# EAGLE design Transducer_board_niall (EAGLE 9.2.0)
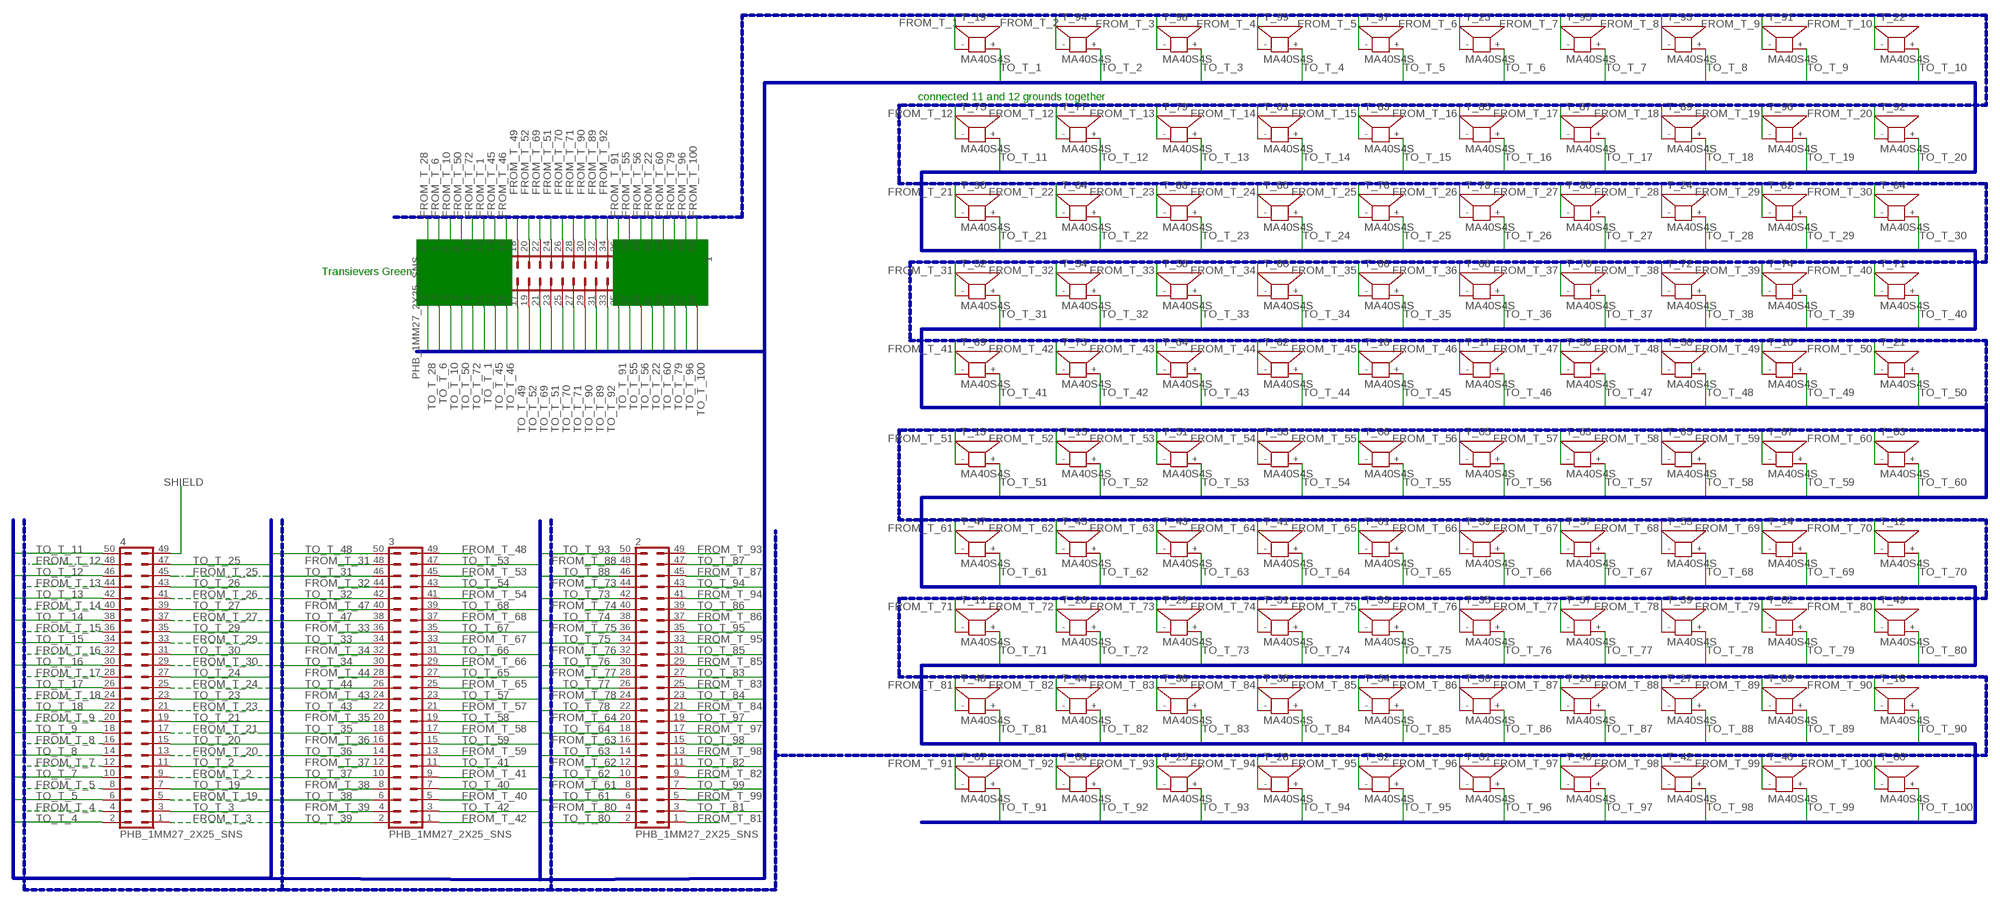
[diagram p0: schematic, sheet 1]

## Parts
1  PHB_1MM27_2X25_SNS  [PHB_1MM27_2X25_SNS]
2  PHB_1MM27_2X25_SNS  [PHB_1MM27_2X25_SNS]
3  PHB_1MM27_2X25_SNS  [PHB_1MM27_2X25_SNS]
4  PHB_1MM27_2X25_SNS  [PHB_1MM27_2X25_SNS]
T_00  MA40S4S  [MA40]
T_01  MA40S4S  [MA40]
T_02  MA40S4S  [MA40]
T_03  MA40S4S  [MA40]
T_04  MA40S4S  [MA40]
T_05  MA40S4S  [MA40]
T_06  MA40S4S  [MA40]
T_07  MA40S4S  [MA40]
T_08  MA40S4S  [MA40]
T_09  MA40S4S  [MA40]
T_10  MA40S4S  [MA40]
T_11  MA40S4S  [MA40]
T_12  MA40S4S  [MA40]
T_13  MA40S4S  [MA40]
T_14  MA40S4S  [MA40]
T_15  MA40S4S  [MA40]
T_16  MA40S4S  [MA40]
T_17  MA40S4S  [MA40]
T_18  MA40S4S  [MA40]
T_19  MA40S4S  [MA40]
T_20  MA40S4S  [MA40]
T_21  MA40S4S  [MA40]
T_22  MA40S4S  [MA40]
T_23  MA40S4S  [MA40]
T_24  MA40S4S  [MA40]
T_25  MA40S4S  [MA40]
T_26  MA40S4S  [MA40]
T_27  MA40S4S  [MA40]
T_28  MA40S4S  [MA40]
T_29  MA40S4S  [MA40]
T_30  MA40S4S  [MA40]
T_31  MA40S4S  [MA40]
T_32  MA40S4S  [MA40]
T_33  MA40S4S  [MA40]
T_34  MA40S4S  [MA40]
T_35  MA40S4S  [MA40]
T_36  MA40S4S  [MA40]
T_37  MA40S4S  [MA40]
T_38  MA40S4S  [MA40]
T_39  MA40S4S  [MA40]
T_40  MA40S4S  [MA40]
T_41  MA40S4S  [MA40]
T_42  MA40S4S  [MA40]
T_43  MA40S4S  [MA40]
T_44  MA40S4S  [MA40]
T_45  MA40S4S  [MA40]
T_46  MA40S4S  [MA40]
T_47  MA40S4S  [MA40]
T_48  MA40S4S  [MA40]
T_49  MA40S4S  [MA40]
T_50  MA40S4S  [MA40]
T_51  MA40S4S  [MA40]
T_52  MA40S4S  [MA40]
T_53  MA40S4S  [MA40]
T_54  MA40S4S  [MA40]
T_55  MA40S4S  [MA40]
T_56  MA40S4S  [MA40]
T_57  MA40S4S  [MA40]
T_58  MA40S4S  [MA40]
T_59  MA40S4S  [MA40]
T_60  MA40S4S  [MA40]
T_61  MA40S4S  [MA40]
T_62  MA40S4S  [MA40]
T_63  MA40S4S  [MA40]
T_64  MA40S4S  [MA40]
T_65  MA40S4S  [MA40]
T_66  MA40S4S  [MA40]
T_67  MA40S4S  [MA40]
T_68  MA40S4S  [MA40]
T_69  MA40S4S  [MA40]
T_70  MA40S4S  [MA40]
T_71  MA40S4S  [MA40]
T_72  MA40S4S  [MA40]
T_73  MA40S4S  [MA40]
T_74  MA40S4S  [MA40]
T_75  MA40S4S  [MA40]
T_76  MA40S4S  [MA40]
T_77  MA40S4S  [MA40]
T_78  MA40S4S  [MA40]
T_79  MA40S4S  [MA40]
T_80  MA40S4S  [MA40]
T_81  MA40S4S  [MA40]
T_82  MA40S4S  [MA40]
T_83  MA40S4S  [MA40]
T_84  MA40S4S  [MA40]
T_85  MA40S4S  [MA40]
T_86  MA40S4S  [MA40]
T_87  MA40S4S  [MA40]
T_88  MA40S4S  [MA40]
T_89  MA40S4S  [MA40]
T_90  MA40S4S  [MA40]
T_91  MA40S4S  [MA40]
T_92  MA40S4S  [MA40]
T_93  MA40S4S  [MA40]
T_94  MA40S4S  [MA40]
T_95  MA40S4S  [MA40]
T_96  MA40S4S  [MA40]
T_97  MA40S4S  [MA40]
T_98  MA40S4S  [MA40]
T_99  MA40S4S  [MA40]

## Nets
FROM_T_1: 1.12 T_19.-
FROM_T_2: 4.9 T_94.-
FROM_T_3: 4.1 T_98.-
FROM_T_4: 4.4 T_99.-
FROM_T_5: 4.8 T_97.-
FROM_T_6: 1.4 T_23.-
FROM_T_7: 4.12 T_95.-
FROM_T_8: 4.16 T_93.-
FROM_T_9: 4.20 T_91.-
FROM_T_10: 1.6 T_22.-
FROM_T_12: 4.48 T_75.- T_77.-
FROM_T_13: 4.44 T_79.-
FROM_T_14: 4.40 T_81.-
FROM_T_15: 4.36 T_83.-
FROM_T_16: 4.32 T_85.-
FROM_T_17: 4.28 T_87.-
FROM_T_18: 4.24 T_89.-
FROM_T_19: 4.5 T_96.-
FROM_T_20: 4.13 T_92.-
FROM_T_21: 4.17 T_90.-
FROM_T_22: 1.42 T_04.-
FROM_T_23: 4.21 T_88.-
FROM_T_24: 4.25 T_86.-
FROM_T_25: 4.45 T_76.-
FROM_T_26: 4.41 T_78.-
FROM_T_27: 4.37 T_80.-
FROM_T_28: 1.2 T_24.-
FROM_T_29: 4.33 T_82.-
FROM_T_30: 4.29 T_84.-
FROM_T_31: 3.48 T_52.-
FROM_T_32: 3.44 T_54.-
FROM_T_33: 3.36 T_58.-
FROM_T_34: 3.32 T_60.-
FROM_T_35: 3.20 T_66.-
FROM_T_36: 3.16 T_68.-
FROM_T_37: 3.12 T_70.-
FROM_T_38: 3.8 T_72.-
FROM_T_39: 3.4 T_74.-
FROM_T_40: 3.5 T_71.-
FROM_T_41: 3.9 T_69.-
FROM_T_42: 3.1 T_73.-
FROM_T_43: 3.24 T_64.-
FROM_T_44: 3.28 T_62.-
FROM_T_45: 1.14 T_18.-
FROM_T_46: 1.16 T_17.-
FROM_T_47: 3.40 T_56.-
FROM_T_48: 3.49 T_50.-
FROM_T_49: 1.18 T_16.-
FROM_T_50: 1.8 T_21.-
FROM_T_51: 1.24 T_13.-
FROM_T_52: 1.20 T_15.-
FROM_T_53: 3.45 T_51.-
FROM_T_54: 3.41 T_53.-
FROM_T_55: 1.38 T_06.-
FROM_T_56: 1.40 T_05.-
FROM_T_57: 3.21 T_63.-
FROM_T_58: 3.17 T_65.-
FROM_T_59: 3.13 T_67.-
FROM_T_60: 1.44 T_03.-
FROM_T_61: 2.8 T_47.-
FROM_T_62: 2.12 T_45.-
FROM_T_63: 2.16 T_43.-
FROM_T_64: 2.20 T_41.-
FROM_T_65: 3.25 T_61.-
FROM_T_66: 3.29 T_59.-
FROM_T_67: 3.33 T_57.-
FROM_T_68: 3.37 T_55.-
FROM_T_69: 1.22 T_14.-
FROM_T_70: 1.26 T_12.-
FROM_T_71: 1.28 T_11.-
FROM_T_72: 1.10 T_20.-
FROM_T_73: 2.44 T_29.-
FROM_T_74: 2.40 T_31.-
FROM_T_75: 2.36 T_33.-
FROM_T_76: 2.32 T_35.-
FROM_T_77: 2.28 T_37.-
FROM_T_78: 2.24 T_39.-
FROM_T_79: 1.46 T_02.-
FROM_T_80: 2.4 T_49.-
FROM_T_81: 2.1 T_48.-
FROM_T_82: 2.9 T_44.-
FROM_T_83: 2.25 T_36.-
FROM_T_84: 2.21 T_38.-
FROM_T_85: 2.29 T_34.-
FROM_T_86: 2.37 T_30.-
FROM_T_87: 2.45 T_26.-
FROM_T_88: 2.48 T_27.-
FROM_T_89: 1.32 T_09.-
FROM_T_90: 1.30 T_10.-
FROM_T_91: 1.36 T_07.-
FROM_T_92: 1.34 T_08.-
FROM_T_93: 2.49 T_25.-
FROM_T_94: 2.41 T_28.-
FROM_T_95: 2.33 T_32.-
FROM_T_96: 1.48 T_01.-
FROM_T_97: 2.17 T_40.-
FROM_T_98: 2.13 T_42.-
FROM_T_99: 2.5 T_46.-
FROM_T_100: 1.50 T_00.-
SHIELD: 4.49
TO_T_1: 1.11 T_19.+
TO_T_2: 4.11 T_94.+
TO_T_3: 4.3 T_98.+
TO_T_4: 4.2 T_99.+
TO_T_5: 4.6 T_97.+
TO_T_6: 1.3 T_23.+
TO_T_7: 4.10 T_95.+
TO_T_8: 4.14 T_93.+
TO_T_9: 4.18 T_91.+
TO_T_10: 1.5 T_22.+
TO_T_11: 4.50 T_75.+
TO_T_12: 4.46 T_77.+
TO_T_13: 4.42 T_79.+
TO_T_14: 4.38 T_81.+
TO_T_15: 4.34 T_83.+
TO_T_16: 4.30 T_85.+
TO_T_17: 4.26 T_87.+
TO_T_18: 4.22 T_89.+
TO_T_19: 4.7 T_96.+
TO_T_20: 4.15 T_92.+
TO_T_21: 4.19 T_90.+
TO_T_22: 1.41 T_04.+
TO_T_23: 4.23 T_88.+
TO_T_24: 4.27 T_86.+
TO_T_25: 4.47 T_76.+
TO_T_26: 4.43 T_78.+
TO_T_27: 4.39 T_80.+
TO_T_28: 1.1 T_24.+
TO_T_29: 4.35 T_82.+
TO_T_30: 4.31 T_84.+
TO_T_31: 3.46 T_52.+
TO_T_32: 3.42 T_54.+
TO_T_33: 3.34 T_58.+
TO_T_34: 3.30 T_60.+
TO_T_35: 3.18 T_66.+
TO_T_36: 3.14 T_68.+
TO_T_37: 3.10 T_70.+
TO_T_38: 3.6 T_72.+
TO_T_39: 3.2 T_74.+
TO_T_40: 3.7 T_71.+
TO_T_41: 3.11 T_69.+
TO_T_42: 3.3 T_73.+
TO_T_43: 3.22 T_64.+
TO_T_44: 3.26 T_62.+
TO_T_45: 1.13 T_18.+
TO_T_46: 1.15 T_17.+
TO_T_47: 3.38 T_56.+
TO_T_48: 3.50 T_50.+
TO_T_49: 1.17 T_16.+
TO_T_50: 1.7 T_21.+
TO_T_51: 1.23 T_13.+
TO_T_52: 1.19 T_15.+
TO_T_53: 3.47 T_51.+
TO_T_54: 3.43 T_53.+
TO_T_55: 1.37 T_06.+
TO_T_56: 1.39 T_05.+
TO_T_57: 3.23 T_63.+
TO_T_58: 3.19 T_65.+
TO_T_59: 3.15 T_67.+
TO_T_60: 1.43 T_03.+
TO_T_61: 2.6 T_47.+
TO_T_62: 2.10 T_45.+
TO_T_63: 2.14 T_43.+
TO_T_64: 2.18 T_41.+
TO_T_65: 3.27 T_61.+
TO_T_66: 3.31 T_59.+
TO_T_67: 3.35 T_57.+
TO_T_68: 3.39 T_55.+
TO_T_69: 1.21 T_14.+
TO_T_70: 1.25 T_12.+
TO_T_71: 1.27 T_11.+
TO_T_72: 1.9 T_20.+
TO_T_73: 2.42 T_29.+
TO_T_74: 2.38 T_31.+
TO_T_75: 2.34 T_33.+
TO_T_76: 2.30 T_35.+
TO_T_77: 2.26 T_37.+
TO_T_78: 2.22 T_39.+
TO_T_79: 1.45 T_02.+
TO_T_80: 2.2 T_49.+
TO_T_81: 2.3 T_48.+
TO_T_82: 2.11 T_44.+
TO_T_83: 2.27 T_36.+
TO_T_84: 2.23 T_38.+
TO_T_85: 2.31 T_34.+
TO_T_86: 2.39 T_30.+
TO_T_87: 2.47 T_26.+
TO_T_88: 2.46 T_27.+
TO_T_89: 1.31 T_09.+
TO_T_90: 1.29 T_10.+
TO_T_91: 1.35 T_07.+
TO_T_92: 1.33 T_08.+
TO_T_93: 2.50 T_25.+
TO_T_94: 2.43 T_28.+
TO_T_95: 2.35 T_32.+
TO_T_96: 1.47 T_01.+
TO_T_97: 2.19 T_40.+
TO_T_98: 2.15 T_42.+
TO_T_99: 2.7 T_46.+
TO_T_100: 1.49 T_00.+

## Buses
TO_T:TO_T_1,TO_T_2,TO_T_3,TO_T_4,TO_T_5,TO_T_6,TO_T_7,TO_T_8,TO_T_9,TO_T_10,TO_T_11,TO_T_12,TO_T_13,TO_T_14,TO_T_15,TO_T_16,TO_T_17,TO_T_18,TO_T_19,TO_T_20,TO_T_21,TO_T_22,TO_T_23,TO_T_24,TO_T_25,TO_T_26,TO_T_27,TO_T_28,TO_T_29,TO_T_30,TO_T_31,TO_T_32,TO_T_33,TO_T_34,TO_T_35,TO_T_36,TO_T_37,TO_T_38,TO_T_39,TO_T_40,TO_T_41,TO_T_42,TO_T_43,TO_T_44,TO_T_45,TO_T_46,TO_T_47,TO_T_48,TO_T_49,TO_T_50,TO_T_51,TO_T_52,TO_T_53,TO_T_54,TO_T_55,TO_T_56,TO_T_57,TO_T_58,TO_T_59,TO_T_60,TO_T_61,TO_T_62,TO_T_63,TO_T_64,TO_T_65,TO_T_66,TO_T_67,TO_T_68,TO_T_69,TO_T_70,TO_T_71,TO_T_72,TO_T_73,TO_T_74,TO_T_75,TO_T_76,TO_T_77,TO_T_78,TO_T_79,TO_T_80,TO_T_81,TO_T_82,TO_T_83,TO_T_84,TO_T_85,TO_T_86,TO_T_87,TO_T_88,TO_T_89,TO_T_90,TO_T_91,TO_T_92,TO_T_93,TO_T_94,TO_T_95,TO_T_96,TO_T_97,TO_T_98,TO_T_99,TO_T_100
FROM_T:FROM_T_1,FROM_T_2,FROM_T_3,FROM_T_4,FROM_T_5,FROM_T_6,FROM_T_7,FROM_T_8,FROM_T_9,FROM_T_10,FROM_T_11,FROM_T_12,FROM_T_13,FROM_T_14,FROM_T_15,FROM_T_16,FROM_T_17,FROM_T_18,FROM_T_19,FROM_T_20,FROM_T_21,FROM_T_22,FROM_T_23,FROM_T_24,FROM_T_25,FROM_T_26,FROM_T_27,FROM_T_28,FROM_T_29,FROM_T_30,FROM_T_31,FROM_T_32,FROM_T_33,FROM_T_34,FROM_T_35,FROM_T_36,FROM_T_37,FROM_T_38,FROM_T_39,FROM_T_40,FROM_T_41,FROM_T_42,FROM_T_43,FROM_T_44,FROM_T_45,FROM_T_46,FROM_T_47,FROM_T_48,FROM_T_49,FROM_T_50,FROM_T_51,FROM_T_52,FROM_T_53,FROM_T_54,FROM_T_55,FROM_T_56,FROM_T_57,FROM_T_58,FROM_T_59,FROM_T_60,FROM_T_61,FROM_T_62,FROM_T_63,FROM_T_64,FROM_T_65,FROM_T_66,FROM_T_67,FROM_T_68,FROM_T_69,FROM_T_70,FROM_T_71,FROM_T_72,FROM_T_73,FROM_T_74,FROM_T_75,FROM_T_76,FROM_T_77,FROM_T_78,FROM_T_79,FROM_T_80,FROM_T_81,FROM_T_82,FROM_T_83,FROM_T_84,FROM_T_85,FROM_T_86,FROM_T_87,FROM_T_88,FROM_T_89,FROM_T_90,FROM_T_91,FROM_T_92,FROM_T_93,FROM_T_94,FROM_T_95,FROM_T_96,FROM_T_97,FROM_T_98,FROM_T_99,FROM_T_100

## Notes on the sheet
- connected 11 and 12 grounds together
- Transievers Green

## Library data of the parts
1-4 = _hhn_con_pinhead_box_1mm27:PHB_1MM27_2X25_*: Pin Header Box-Type, 1.27mm/0.5"/50mil Pitch, 2x25 Circuits Note: see library description for an important note about THT-version
T_00 T_01-T_09 T_10-T_99 = Parts:MA40S4S: SPEAKER Source: Buerklin

## Board
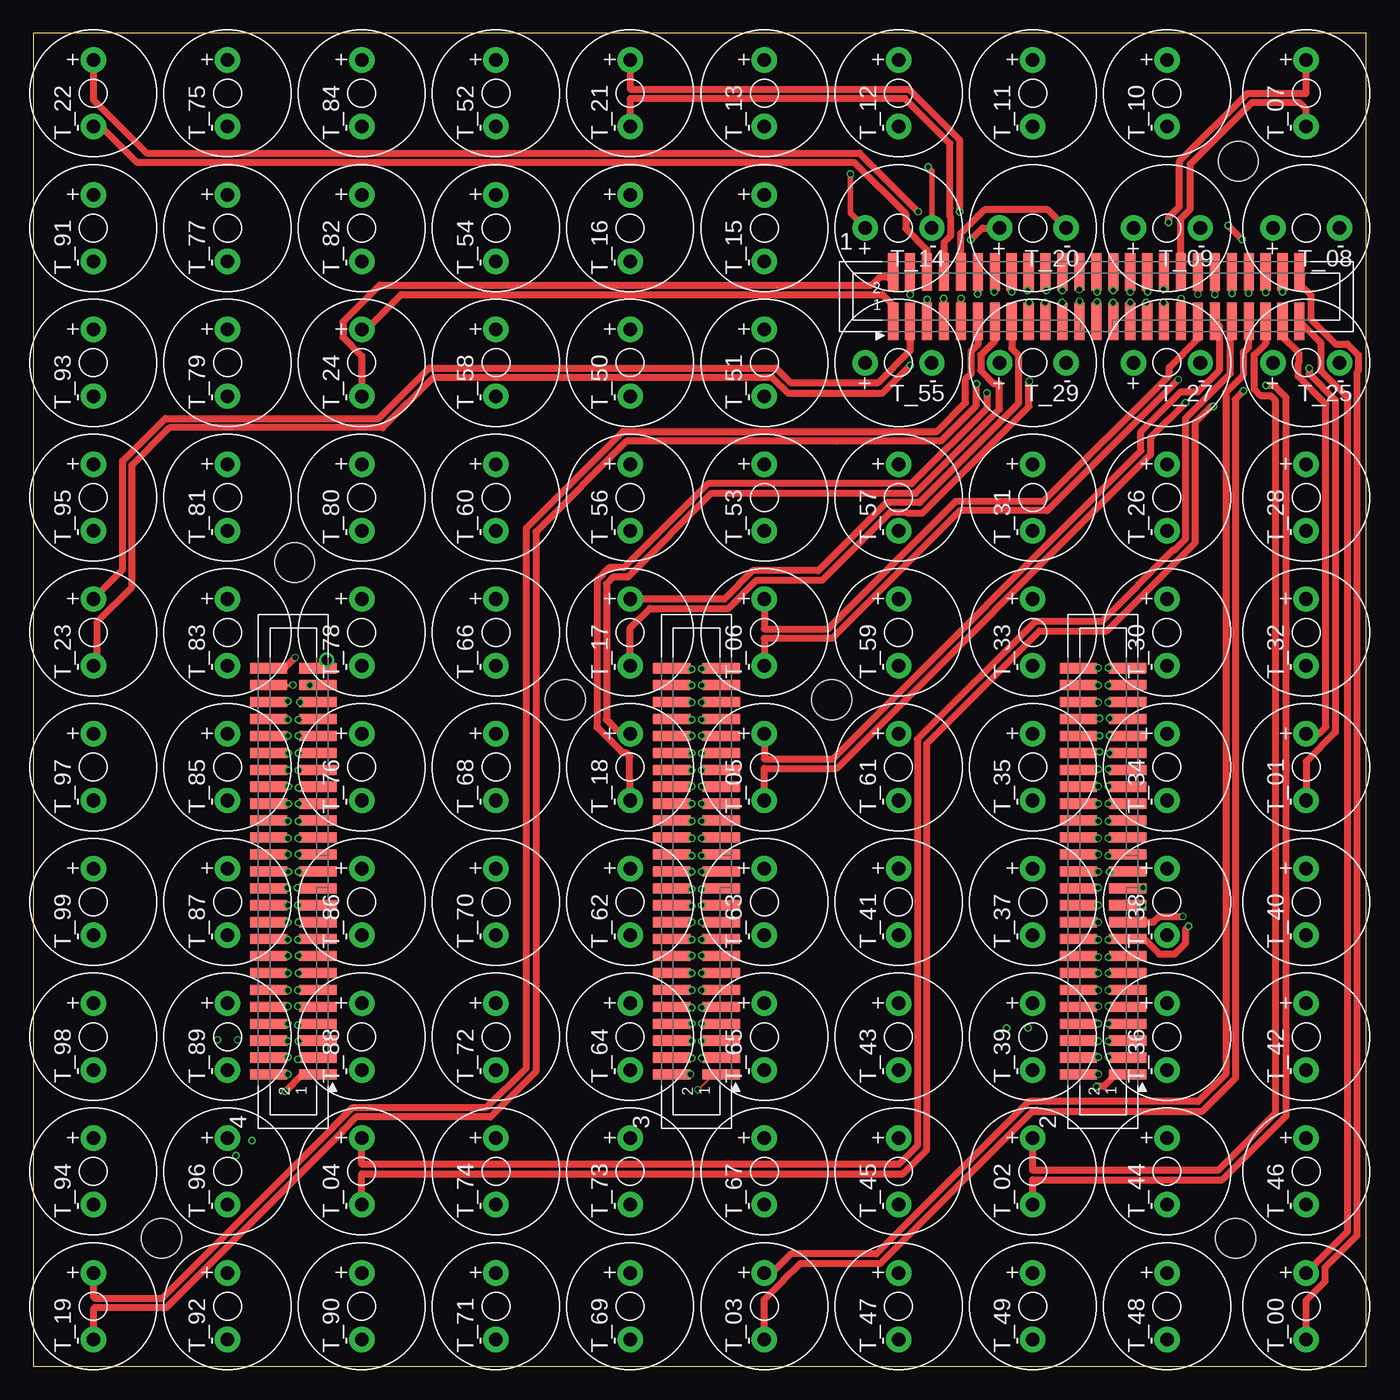
[diagram p1: board, top side]
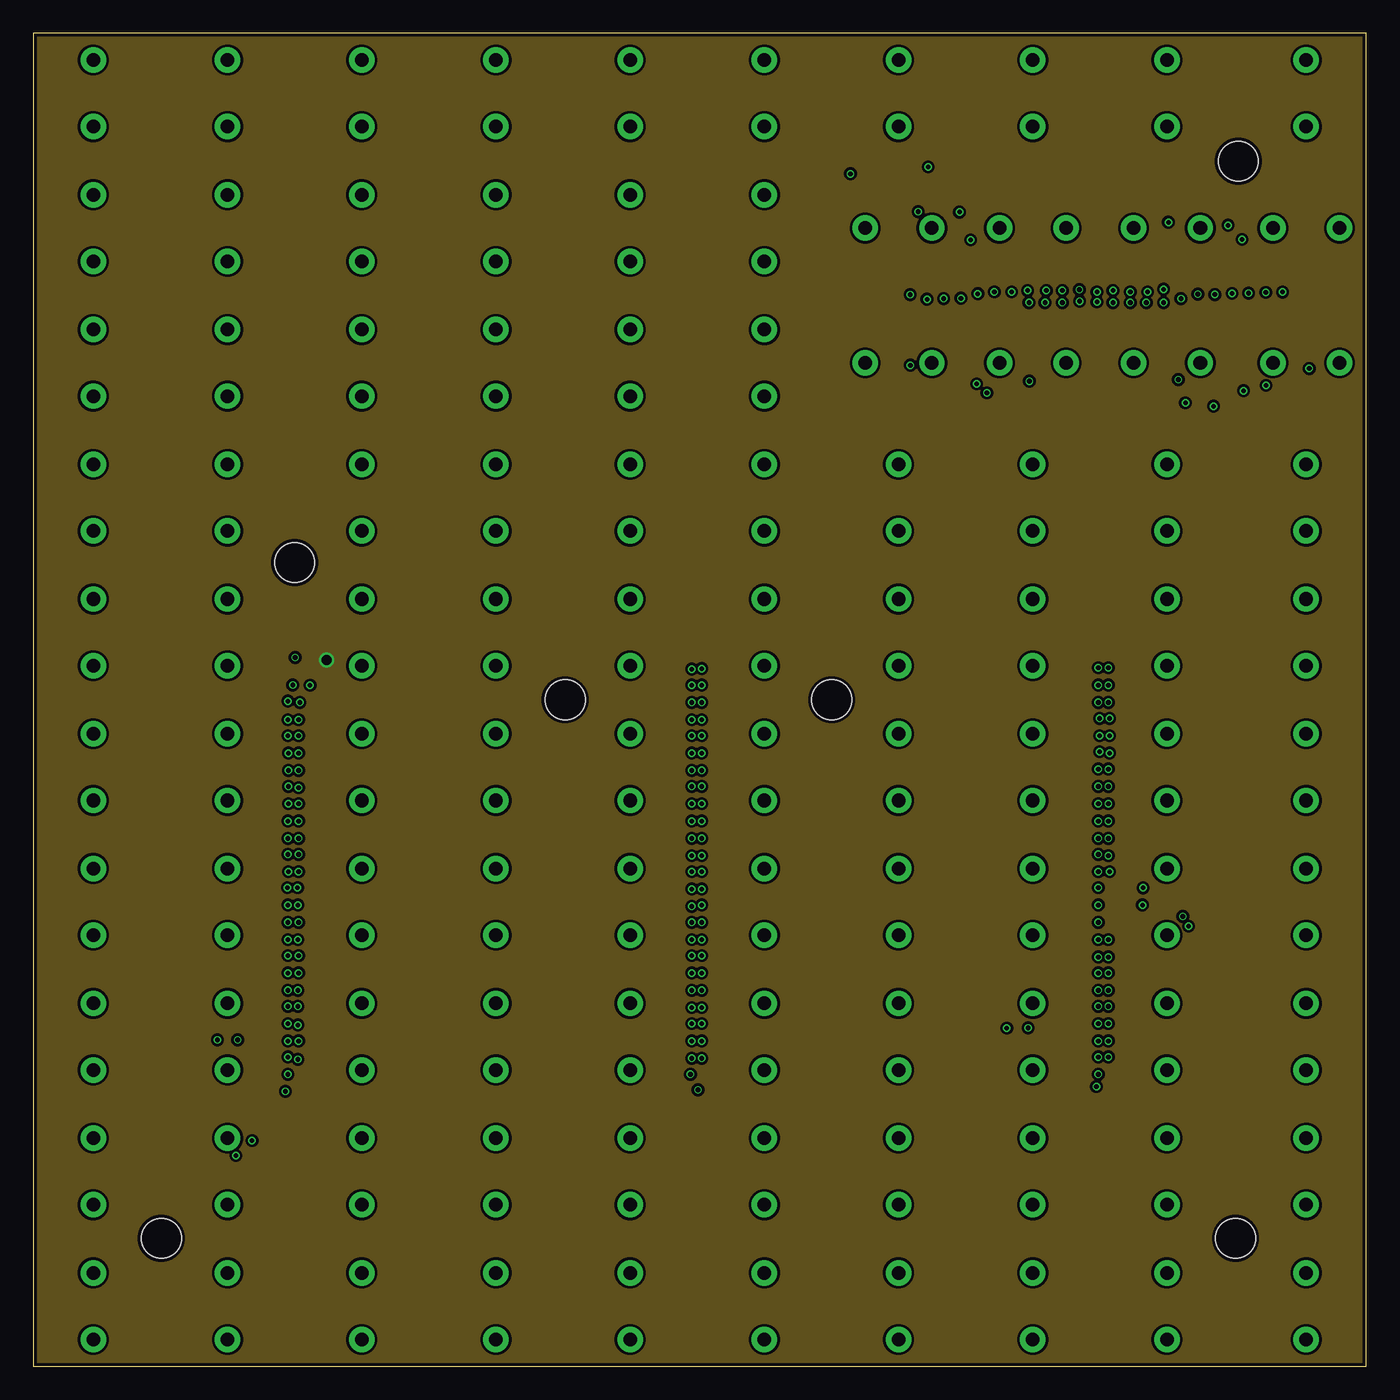
[diagram p2: board, inner layer Shield]
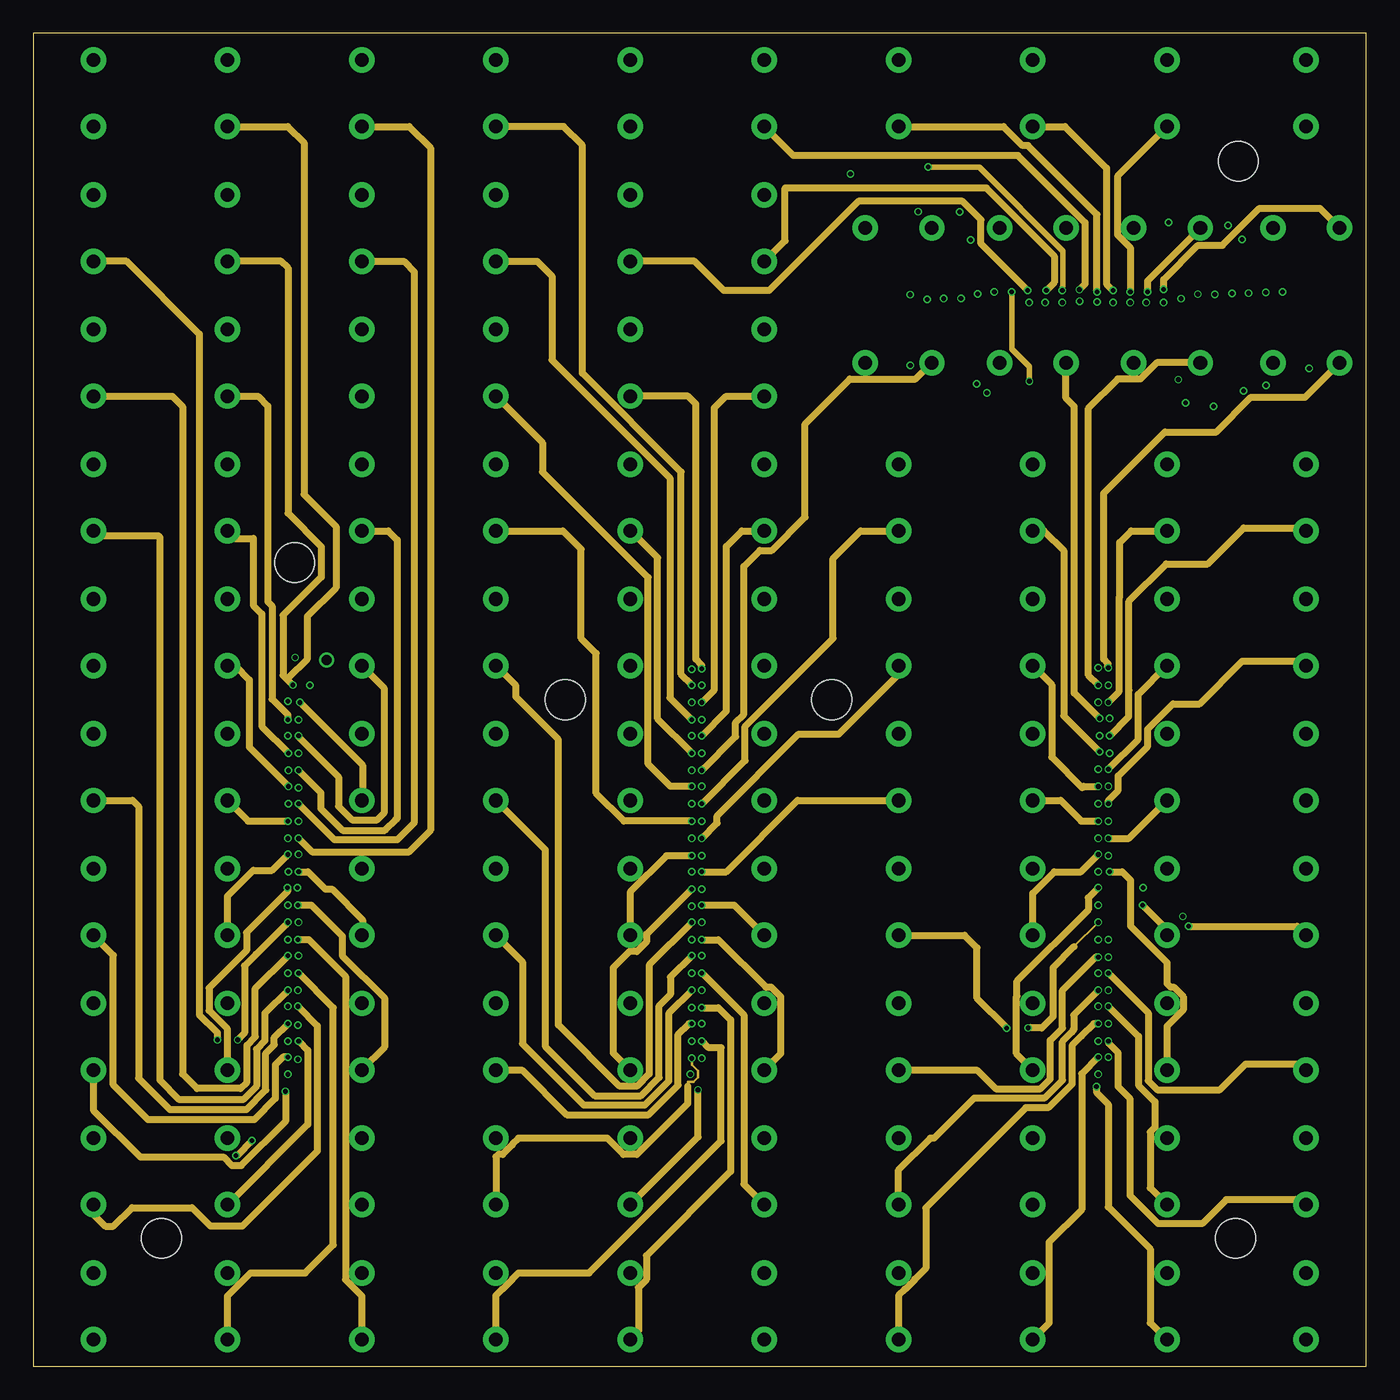
[diagram p3: board, inner layer Route]
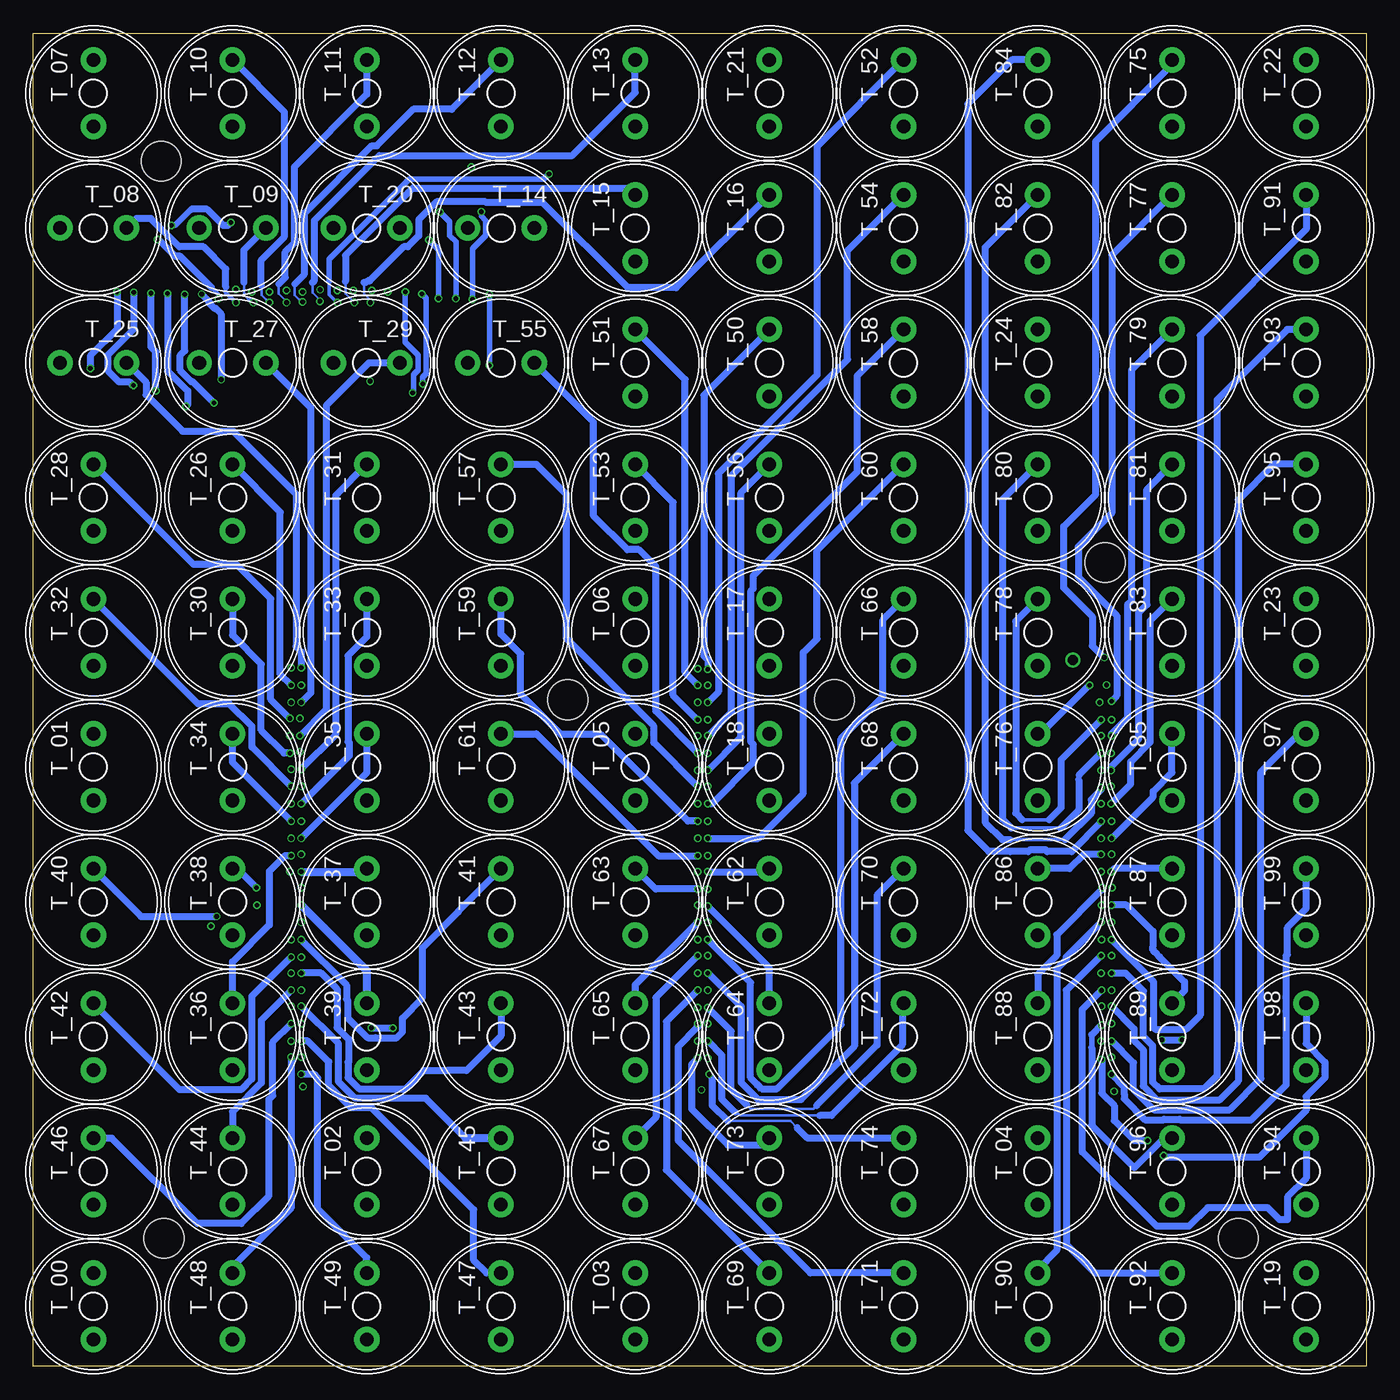
[diagram p4: board, bottom side, seen from below]

Size 100 x 100 mm. Coordinates in mm from the lower left corner, seen from the top.
Outline: 0,0 100,0 100,100 0,100 0,0
Copper layers (1*2*3*16): Top 0.035mm / dielectric 0.2mm / Shield 0.0175mm / dielectric 0.3mm / Route 0.035mm / dielectric 0.2mm / Bottom 0.035mm
Design rules "SeeedStudio_4layer_DRU_no_angle_20140221": minimum track width 8mil, minimum drill 12mil, track to track 8mil, track to pad 8mil, pad to pad 8mil, via to via 8mil, smd to smd 0mil, copper to edge 10mil, drill to drill 8mil, minimum pad ring 6mil, minimum via ring 4mil, stop-mask expansion 4mil, vias tented up to drill 25mil, thermal gap 10mil
Holes 3 mm at 9.6,9.6 90.2,9.6 90.4,90.4 19.6,60.3 39.9,50 59.9,50

### Footprints (pad centres in the part's own frame; a part is rotated, then mirrored left to right if it is on the bottom)
PHB_1MM27_2X25_SNS = smd 0.76 x 2.8: 1 -15.24,-1.85; 2 -15.24,1.85; 3 -13.97,-1.85; 4 -13.97,1.85; 5 -12.7,-1.85; 6 -12.7,1.85; 7 -11.43,-1.85; 8 -11.43,1.85; 9 -10.16,-1.85; 10 -10.16,1.85; 11 -8.89,-1.85; 12 -8.89,1.85; 13 -7.62,-1.85; 14 -7.62,1.85; 15 -6.35,-1.85; 16 -6.35,1.85; 17 -5.08,-1.85; 18 -5.08,1.85; 19 -3.81,-1.85; 20 -3.81,1.85; 21 -2.54,-1.85; 22 -2.54,1.85; 23 -1.27,-1.85; 24 -1.27,1.85; 25 0,-1.85; 26 0,1.85; 27 1.27,-1.85; 28 1.27,1.85; 29 2.54,-1.85; 30 2.54,1.85; 31 3.81,-1.85; 32 3.81,1.85; 33 5.08,-1.85; 34 5.08,1.85; 35 6.35,-1.85; 36 6.35,1.85; 37 7.62,-1.85; 38 7.62,1.85; 39 8.89,-1.85; 40 8.89,1.85; 41 10.16,-1.85; 42 10.16,1.85; 43 11.43,-1.85; 44 11.43,1.85; 45 12.7,-1.85; 46 12.7,1.85; 47 13.97,-1.85; 48 13.97,1.85; 49 15.24,-1.85; 50 15.24,1.85
MA40 = drill 1.016 pad 1.905: + 2.5,0; - -2.5,0

### Placement (x,y rotation side)
1  79.75,80.25 0 top
2  80.25,37.12 90 top
3  49.75,37.12 90 top
4  19.5,37.12 90 top
T_00  95.5,4.5 90 bottom
T_01  95.5,44.94 90 bottom
T_02  74.99,14.61 90 bottom
T_03  54.85,4.5 90 bottom
T_04  24.64,14.61 90 bottom
T_05  54.85,44.94 90 bottom
T_06  54.85,55.06 90 bottom
T_07  95.5,95.5 90 bottom
T_08  95.5,85.39 0 bottom
T_09  85.06,85.39 0 bottom
T_10  85.06,95.5 90 bottom
T_11  74.99,95.5 90 bottom
T_12  64.92,95.5 90 bottom
T_13  54.85,95.5 90 bottom
T_14  64.92,85.39 0 bottom
T_15  54.85,85.39 90 bottom
T_16  44.78,85.39 90 bottom
T_17  44.78,55.06 90 bottom
T_18  44.78,44.94 90 bottom
T_19  4.5,4.5 90 bottom
T_20  74.99,85.39 0 bottom
T_21  44.78,95.5 90 bottom
T_22  4.5,95.5 90 bottom
T_23  4.5,55.06 90 bottom
T_24  24.64,75.28 90 bottom
T_25  95.5,75.28 0 bottom
T_26  85.06,65.17 90 bottom
T_27  85.06,75.28 0 bottom
T_28  95.5,65.17 90 bottom
T_29  74.99,75.28 0 bottom
T_30  85.06,55.06 90 bottom
T_31  74.99,65.17 90 bottom
T_32  95.5,55.06 90 bottom
T_33  74.99,55.06 90 bottom
T_34  85.06,44.94 90 bottom
T_35  74.99,44.94 90 bottom
T_36  85.06,24.72 90 bottom
T_37  74.99,34.83 90 bottom
T_38  85.06,34.83 90 bottom
T_39  74.99,24.72 90 bottom
T_40  95.5,34.83 90 bottom
T_41  64.92,34.83 90 bottom
T_42  95.5,24.72 90 bottom
T_43  64.92,24.72 90 bottom
T_44  85.06,14.61 90 bottom
T_45  64.92,14.61 90 bottom
T_46  95.5,14.61 90 bottom
T_47  64.92,4.5 90 bottom
T_48  85.06,4.5 90 bottom
T_49  74.99,4.5 90 bottom
T_50  44.78,75.28 90 bottom
T_51  54.85,75.28 90 bottom
T_52  34.71,95.5 90 bottom
T_53  54.85,65.17 90 bottom
T_54  34.71,85.39 90 bottom
T_55  64.92,75.28 0 bottom
T_56  44.78,65.17 90 bottom
T_57  64.92,65.17 90 bottom
T_58  34.71,75.28 90 bottom
T_59  64.92,55.06 90 bottom
T_60  34.71,65.17 90 bottom
T_61  64.92,44.94 90 bottom
T_62  44.78,34.83 90 bottom
T_63  54.85,34.83 90 bottom
T_64  44.78,24.72 90 bottom
T_65  54.85,24.72 90 bottom
T_66  34.71,55.06 90 bottom
T_67  54.85,14.61 90 bottom
T_68  34.71,44.94 90 bottom
T_69  44.78,4.5 90 bottom
T_70  34.71,34.83 90 bottom
T_71  34.71,4.5 90 bottom
T_72  34.71,24.72 90 bottom
T_73  44.78,14.61 90 bottom
T_74  34.71,14.61 90 bottom
T_75  14.57,95.5 90 bottom
T_76  24.64,44.94 90 bottom
T_77  14.57,85.39 90 bottom
T_78  24.64,55.06 90 bottom
T_79  14.57,75.28 90 bottom
T_80  24.64,65.17 90 bottom
T_81  14.57,65.17 90 bottom
T_82  24.64,85.39 90 bottom
T_83  14.57,55.06 90 bottom
T_84  24.64,95.5 90 bottom
T_85  14.57,44.94 90 bottom
T_86  24.64,34.83 90 bottom
T_87  14.57,34.83 90 bottom
T_88  24.64,24.72 90 bottom
T_89  14.57,24.72 90 bottom
T_90  24.64,4.5 90 bottom
T_91  4.5,85.39 90 bottom
T_92  14.57,4.5 90 bottom
T_93  4.5,75.28 90 bottom
T_94  4.5,14.61 90 bottom
T_95  4.5,65.17 90 bottom
T_96  14.57,14.61 90 bottom
T_97  4.5,44.94 90 bottom
T_98  4.5,24.72 90 bottom
T_99  4.5,34.83 90 bottom

### Tracks (layer width: path | path; a pad name or v marks a point on that pad's centre or on a via)
FROM_T_1  (via drill 0.35)
  Top 0.508: 1.12 v70.86,80.46 | T_19.- 4.5,4.3 4.6,4.4 9.98,4.4 23.23,17.65 23.23,17.7 24.23,18.7 34.3,18.7 37.7,22.11 37.7,62.6 44.5,69.4 60.3,69.4 60.32,69.42 68.1,69.42 70.71,72.03 70.71,73.63 v70.78,73.7
  Bottom 0.406: v70.78,73.7 70.78,74.2 70.52,74.46 70.52,80.12 v70.86,80.46
FROM_T_2  (via drill 0.35)
  Top 0.254: 4.9 19.89,26.96 v19.86,27
  Route 0.508: T_94.- 4.5,11.41 5.41,10.5 6,10.5 7.4,11.9 11.9,11.9 13.3,10.5 15.69,10.5 21.31,16.12 21.31,25.55 v19.86,27
FROM_T_3  (via drill 0.35)
  Top 0.508: v18.91,20.62 20.18,21.89 4.1
  Route 0.508: v18.91,20.62 18.91,18.37 15.61,15.07 14.9,15.07 14.27,15.69 8.02,15.69 4.5,19.21 T_98.-
FROM_T_4  (via drill 0.35)
  Top 0.254: 4.4 19.05,23.16 v19.1,23.2
  Route 0.508: T_99.- 6,30.83 6,21.1 8.61,18.49 16.57,18.49 18.16,20.08 18.16,22.62 18.74,23.2 v19.1,23.2
FROM_T_5  (via drill 0.35)
  Top 0.254: 4.8 v19.09,25.7 v19.1,25.7
  Route 0.508: T_97.- 7.46,42.44 7.9,42 7.9,21.6 10.26,19.24 15.97,19.24 17.45,20.71 17.45,23.49 18.09,24.12 18.09,24.68 v19.1,25.7
FROM_T_6  (via drill 0.35)
  Top 0.508: 1.4 v65.78,80.4 | T_23.- 4.8,52.86 4.8,55.86 7.41,58.47 7.41,67.61 10.2,70.4 26.21,70.4 30,74.19 55.43,74.19 56.63,72.99 63.69,72.99 v65.8,75.1
  Bottom 0.406: v65.78,80.4 65.78,75.12 v65.8,75.1
FROM_T_7  (via drill 0.35)
  Top 0.254: 4.12 19.07,28.23 v19.1,28.2
  Route 0.508: T_95.- 4.87,62.3 9.4,62.3 9.5,62.2 9.5,21.46 10.96,20 15.73,20 16.74,21.01 16.74,23.78 17.37,24.41 17.37,26.47 v19.1,28.2
FROM_T_8  (via drill 0.35)
  Top 0.254: 4.16 19.07,30.77 v19.1,30.8
  Route 0.508: T_93.- 10.42,72.78 11.2,72 11.2,21.92 12.29,20.83 15.55,20.83 16.03,21.3 16.03,24.07 16.66,24.71 16.66,28.36 v19.1,30.8
FROM_T_9  (via drill 0.35)
  Top 0.254: 4.20 19.09,33.31 v19.1,33.3
  Route 0.508: T_91.- 7,82.9 12.45,77.45 12.45,28.03 12.46,28.03 12.46,26.37 13.82,25.01 v13.82,24.48 | v15.33,24.48 15.85,25 15.85,30.04 16.7,30.89 16.7,30.9 v19.1,33.3
  Bottom 0.203: 13.92,24.48 v13.82,24.48
  Bottom 0.508: v15.33,24.48 13.92,24.48
FROM_T_10
  Top 0.508: 1.6 67.05,83.75 65.45,85.35 65.45,86.45 61.6,90.3 7.8,90.3 5.1,93 T_22.-
FROM_T_12  (via drill 0.35)
  Top 0.254: 4.48 17.67,51.08 19.46,51.08 v19.46,51.11
  Route 0.508: T_77.- 18.61,82.89 19.1,82.4 19.1,64 21.61,61.49 21.61,59.47 21.6,59.46 21.6,59.2 18.74,56.34 18.74,51.83 v19.46,51.11 19.17,51.41 19.17,51.66 20.57,53.06 20.57,56.27 22.7,58.4 22.7,63 20.3,65.4 20.3,91.8 19.1,93 T_75.-
FROM_T_13  (via drill 0.35)
  Top 0.254: 4.44 19.05,48.55 v19.1,48.5
  Route 0.508: T_79.- 16.86,72.78 17.59,72.05 17.59,57.35 17.91,57.03 17.91,50.05 19.1,48.86 v19.1,48.5
FROM_T_14  (via drill 0.35)
  Top 0.254: 4.40 19.13,46.02 v19.14,46
  Route 0.508: T_81.- 15.14,62.1 16.5,62.1 16.5,57.09 17.14,56.44 17.14,48 v19.14,46
FROM_T_15  (via drill 0.35)
  Top 0.254: 4.36 19.12,43.48 v19.14,43.5
  Route 0.508: T_83.- 15.14,52.56 16.2,51.5 16.2,46.44 v19.14,43.5
FROM_T_16  (via drill 0.35)
  Top 0.254: 4.32 19.07,40.94 v19.1,40.9
  Route 0.508: T_85.- 16.11,40.9 v19.1,40.9
FROM_T_17  (via drill 0.35)
  Top 0.254: 4.28 v19.09,38.4 v19.1,38.4
  Route 0.508: T_87.- 14.57,35.27 16.5,37.2 17.9,37.2 v19.1,38.4
FROM_T_18  (via drill 0.35)
  Top 0.254: 4.24 19.02,35.85 v19.07,35.9
  Route 0.508: v19.07,35.9 19.07,35.6 15.99,32.53 15.99,31.18 13.19,28.38 13.19,26.68 14.57,25.3 T_89.-
FROM_T_19  (via drill 0.35)
  Top 0.254: 4.5 19.93,24.43 v19.9,24.4
  Route 0.508: T_96.- 20.6,18.14 20.6,23.7 v19.9,24.4
FROM_T_20  (via drill 0.35)
  Top 0.254: 4.13 v19.91,29.5 v19.9,29.5
  Route 0.508: T_92.- 14.57,5.27 16.3,7 20.4,7 22.5,9.1 22.5,26.9 v19.9,29.5
FROM_T_21  (via drill 0.35)
  Top 0.254: 4.17 19.9,32.05 v19.86,32
  Route 0.508: v19.86,32 20.68,32 23.42,29.26 23.42,6.5 24.64,5.28 T_90.-
FROM_T_22  (via drill 0.35)
  Top 0.508: T_04.- 24.64,14.45 65.25,14.45 67.04,16.23 67.04,46.72 75.49,55.17 80.56,55.17 87.18,61.79 87.18,70.83 88.37,72.02 v88.54,72.02 | v89.93,80.49 89.93,82.08 1.42
  Bottom 0.508: v89.93,80.49 89.93,74.66 88.43,73.16 88.4,73.16 88.4,72.17 v88.54,72.02
FROM_T_23  (via drill 0.35)
  Top 0.254: 4.21 19.87,34.59 v19.86,34.6
  Route 0.508: T_88.- 26.34,23.92 26.34,27.64 23.19,30.8 23.19,32.27 20.86,34.6 v19.86,34.6
FROM_T_24  (via drill 0.35)
  Top 0.254: 4.25 21.32,37.1 v19.9,37.1
  Route 0.508: T_86.- 24.7,32.39 24.7,33.5 22.4,35.8 21.9,35.8 20.6,37.1 v19.9,37.1
FROM_T_25  (via drill 0.35)
  Top 0.254: 4.45 20.02,49.83 v20,49.8
  Route 0.254: 24.7,42.5 T_76.-
  Route 0.508: v20,49.8 24.7,45.1 24.7,42.5
FROM_T_26  (via drill 0.35)
  Top 0.254: 4.41 19.91,47.28 v19.9,47.3
  Route 0.508: T_78.- 26.3,50.89 26.3,41.5 25.8,41 23.9,41 22.9,42 22.9,44.21 19.9,47.21 v19.9,47.3
FROM_T_27  (via drill 0.35)
  Top 0.254: 4.37 19.95,44.74 v19.9,44.7
  Route 0.508: v19.9,44.7 21.56,43.04 21.56,41.84 23.19,40.21 26.38,40.21 26.46,40.29 27.17,41 27.3,41.13 27.3,62 26.63,62.67 T_80.-
FROM_T_28
  Top 0.508: 1.2 64.11,81.7 63.5,81.7 62.92,81.12 25.99,81.12 23.23,78.36 23.23,77.19 24.64,75.78 T_24.-
FROM_T_29  (via drill 0.35)
  Top 0.254: 4.33 v19.91,42.2 v19.9,42.2
  Route 0.508: T_82.- 27.81,82.89 28.6,82.1 28.6,74.7 28.6,73.7 28.6,68 28.6,66 28.6,40.8 27.3,39.5 22.6,39.5 v19.9,42.2
FROM_T_30  (via drill 0.35)
  Top 0.254: 4.29 19.96,39.66 v19.9,39.6
  Route 0.508: v19.9,39.6 20.9,38.6 28.2,38.6 29.8,40.2 29.8,91.4 28.2,93 T_84.-
FROM_T_31  (via drill 0.35)
  Top 0.203: 3.48 v49.4,51.09 v49.4,51.1
  Route 0.508: T_52.- 39.8,93 41.2,91.6 41.2,74.5 48.6,67.1 48.6,51.9 v49.4,51.1
FROM_T_32  (via drill 0.35)
  Top 0.203: 3.44 49.34,48.55 v49.4,48.5
  Route 0.508: T_54.- 37.81,82.89 38.9,81.8 38.9,75.5 47.75,66.65 47.75,50.15 v49.4,48.5
FROM_T_33  (via drill 0.35)
  Top 0.203: 3.36 49.38,43.48 v49.4,43.5
  Route 0.508: v49.4,43.5 47.8,43.5 46.13,45.17 46.13,59.17 38.2,67.1 38.2,69.29 T_58.-
FROM_T_34  (via drill 0.35)
  Top 0.203: 3.32 49.37,40.94 v49.4,40.9
  Route 0.508: T_60.- 39.73,62.67 41.1,61.3 41.1,54.61 42.23,53.48 42.23,42.97 44.3,40.9 v49.4,40.9
FROM_T_35  (via drill 0.35)
  Top 0.203: 3.20 49.38,33.31 v49.4,33.3
  Route 0.508: v49.4,33.3 46.2,30.1 46.2,21.92 45.28,21 44,21 39.4,25.6 39.4,47.01 36.2,50.21 36.2,51.06 T_66.-
FROM_T_36  (via drill 0.35)
  Top 0.203: 3.16 49.38,30.77 v49.4,30.8
  Route 0.508: v49.4,30.8 47.8,29.2 47.8,27.89 46.95,27.05 46.95,21.67 45.58,20.29 42.11,20.29 38.4,24 38.4,38.75 T_68.-
FROM_T_37  (via drill 0.35)
  Top 0.203: 3.12 49.37,28.23 v49.4,28.2
  Route 0.508: v49.4,28.2 47.66,26.46 47.66,21.37 45.87,19.58 41.31,19.58 36.7,24.19 36.7,30.34 T_70.-
FROM_T_38  (via drill 0.35)
  Top 0.203: 3.8 v49.4,25.7
  Route 0.508: T_72.- 36.67,22.22 40.02,18.87 46.17,18.87 48.38,21.08 48.38,24.9 49.18,25.7 v49.4,25.7
FROM_T_39  (via drill 0.35)
  Top 0.203: 3.4 49.34,23.16 v49.4,23.1
  Route 0.203: 49.12,21 49.12,21.3 49.14,21.32 49.54,21.32 49.88,21.66 49.88,22.14 49.4,22.62 v49.4,23.1
  Route 0.508: 49.12,21 49.09,20.97 49.09,19.7 45.28,15.89 44.27,15.89 43.06,17.1 36.4,17.1 35.93,16.63 35.93,16.61 35.21,15.89 34.89,15.89 34.71,15.71 T_74.-
FROM_T_40  (via drill 0.35)
  Top 0.203: 3.5 50.18,24.43 v50.16,24.4
  Route 0.508: T_71.- 34.71,5.31 35.18,5.78 35.21,5.78 35.93,6.5 35.93,6.53 36.4,7 41.7,7 51.6,16.9 51.6,23.9 50.66,23.9 v50.16,24.4
FROM_T_41  (via drill 0.35)
  Top 0.203: 3.9 50.22,26.96 v50.16,26.9
  Route 0.508: v50.16,26.9 51.4,26.9 52.31,25.99 52.31,14.61 46,8.3 46,6.5 45.4,5.9 45.4,2.62 T_69.-
FROM_T_42  (via drill 0.35)
  Top 0.203: 3.1 51.03,21.89 v49.87,20.73
  Route 0.508: T_73.- 49.87,17.21 v49.87,20.73
FROM_T_43  (via drill 0.35)
  Top 0.203: 3.24 49.34,35.85 v49.4,35.8
  Route 0.508: v49.4,35.8 46,32.4 46,31.83 45.28,31.11 44.71,31.11 43.5,29.9 43.5,23.5 T_64.-
FROM_T_44  (via drill 0.35)
  Top 0.203: 3.28 49.3,38.4 v49.4,38.3
  Route 0.508: v49.4,38.3 47.5,38.3 44.78,35.58 T_62.-
FROM_T_45  (via drill 0.35)
  Top 0.508: 1.14 72.13,80.63 v72.1,80.6 | v71.54,73.02 71.54,71.86 65.89,66.21 50.6,66.21 44.3,59.91 43.2,59.91 42.29,58.99 42.29,47.94 44.19,46.03 44.46,46.03 44.75,45.75 44.75,44.03 44.78,44 T_18.-
  Bottom 0.406: v72.1,80.6 72.1,76.81 71.13,75.84 71.13,74.72 71.46,74.38 71.46,73.1 v71.54,73.02
FROM_T_46  (via drill 0.35)
  Top 0.508: v74.73,73.9 74.7,73.87 74.7,72 66.69,63.99 65.59,63.99 65.5,64.08 64.31,64.08 59.2,58.97 54.26,58.97 52.14,56.84 46.25,56.84 44.78,55.37 T_17.- | v73.4,80.6 1.16
  Route 0.406: v73.4,80.6 73.4,76.32 74.73,74.99 v74.73,73.9
FROM_T_47  (via drill 0.35)
  Top 0.203: 3.40 49.38,46.02 v49.4,46
  Route 0.508: v49.4,46 46.84,48.56 46.84,60.66 44.83,62.67 T_56.-
FROM_T_48  (via drill 0.35)
  Top 0.203: 3.49 50.19,52.37 v50.16,52.33
  Route 0.508: v50.16,52.33 50.13,52.36 50.13,52.6 49.7,53.04 49.7,72.2 49.12,72.78 T_50.-
FROM_T_49  (via drill 0.35)
  Top 0.203: 1.18 74.67,80.77 v74.6,80.7
  Route 0.508: v74.6,80.7 71.1,84.2 71.1,86.01 69.71,87.4 61.9,87.4 55.2,80.7 51.8,80.7 49.61,82.89 T_16.-
FROM_T_50
  Top 0.508: 1.8 68.32,84.3 68.83,84.81 68.83,86.21 68.75,86.28 68.75,86.89 68.78,86.92 68.78,91.72 65.4,95.1 44.78,95.1 T_21.-
FROM_T_51  (via drill 0.35)
  Top 0.203: 1.24 v78.48,80.77
  Route 0.508: T_13.- 57.03,90.82 73.88,90.82 78.9,85.8 78.9,81.19 v78.48,80.77
FROM_T_52  (via drill 0.35)
  Top 0.203: 1.20 75.94,80.76 v76,80.7
  Route 0.508: T_15.- 56.4,84.44 56.4,88.39 71.51,88.39 76.6,83.3 76.6,81.3 v76,80.7
FROM_T_53  (via drill 0.35)
  Top 0.203: 3.45 50.18,49.83 v50.16,49.8
  Route 0.508: v50.16,49.8 51.1,50.74 51.1,71.9 51.98,72.78 T_51.-
FROM_T_54  (via drill 0.35)
  Top 0.203: 3.41 50.17,47.28 v50.16,47.3
  Route 0.508: v50.16,47.3 52,49.14 52,61.5 53.17,62.67 T_53.-
FROM_T_55  (via drill 0.35)
  Top 0.508: 1.38 v87.37,80.43 | v85.91,74.02 76.08,64.18 69.5,64.18 59.93,54.61 54.85,54.61 T_06.-
  Bottom 0.508: v85.91,74.02 85.91,78.97 86.3,79.36 86.4,79.36 86.83,79.79 86.83,79.89 v87.37,80.43
FROM_T_56  (via drill 0.35)
  Top 0.508: 1.40 v88.64,80.4 | v86.44,72.27 83.82,69.65 83.82,68.38 60.28,44.85 54.85,44.85 T_05.-
  Bottom 0.508: v88.64,80.4 88.64,76.19 88.97,75.86 88.97,74.69 88.14,73.87 88.04,73.87 v86.44,72.27
FROM_T_57  (via drill 0.35)
  Top 0.203: 3.21 50.17,34.59 v50.16,34.6
  Route 0.508: v50.16,34.6 52.58,34.6 T_63.-
FROM_T_58  (via drill 0.35)
  Top 0.203: 3.17 50.2,32.05 v50.16,32
  Route 0.508: v50.16,32 51.4,32 54.96,28.44 55.35,28.44 56.07,27.73 56.07,23.44 T_65.-
FROM_T_59  (via drill 0.35)
  Top 0.203: 3.13 v50.16,29.5
  Route 0.508: v50.16,29.5 53.3,26.36 53.3,13.66 T_67.-
FROM_T_60  (via drill 0.35)
  Top 0.508: 1.44 v91.18,80.51 | v90.81,73.18 90.17,72.55 90.17,21.59 87.72,19.14 74.97,19.14 63.54,7.71 57.54,7.71 56.26,6.43 56.26,6.42 55.43,5.59 55.42,5.59 54.85,5.02 T_03.-
  Bottom 0.508: v90.81,73.18 90.81,76.11 91.16,76.47 91.16,80.49 v91.18,80.51
FROM_T_61  (via drill 0.35)
  Top 0.203: 2.8 v79.89,25.7 v79.9,25.7
  Route 0.508: T_47.- 64.92,5.31 65.39,5.78 65.42,5.78 66.14,6.5 66.14,6.53 66.95,7.34 66.95,11.88 74.46,19.39 76.15,19.39 77.92,21.16 77.92,24.06 78.63,24.77 78.63,24.78 79.55,25.7 v79.9,25.7
FROM_T_62  (via drill 0.35)
  Top 0.203: 2.12 79.86,28.23 v79.9,28.2
  Route 0.508: T_45.- 64.92,14.72 67.3,17.1 67.57,17.1 70.57,20.1 75.86,20.1 77.21,21.45 77.21,24.36 77.92,25.07 77.92,25.1 78.05,25.23 78.05,26.35 v79.9,28.2
FROM_T_63  (via drill 0.35)
  Top 0.203: 2.16 79.83,30.77 v79.9,30.7
  Route 0.508: v79.9,30.7 79.7,30.7 77.21,28.21 77.21,25.36 76.3,24.45 76.3,21.55 75.56,20.81 72.2,20.81 70.79,22.22 T_43.-
FROM_T_64  (via drill 0.35)
  Top 0.203: 2.20 79.89,33.31 v79.9,33.3
  Route 0.203: v79.9,33.3 78.08,31.48
  Route 0.508: T_41.- 69.87,32.33 70.8,31.4 70.8,27.6 v73.03,25.37 | 78.08,31.48 76.5,29.9 76.5,26.22 75.66,25.38 v74.63,25.38
  Bottom 0.508: v74.63,25.38 73.04,25.38 v73.03,25.37
FROM_T_65  (via drill 0.35)
  Top 0.203: 3.25 50.18,37.12 v50.16,37.1
  Route 0.508: v50.16,37.1 52,37.1 57.34,42.44 T_61.-
FROM_T_66  (via drill 0.35)
  Top 0.203: 3.29 51.53,39.6 v50.16,39.6
  Route 0.508: v50.16,39.6 51.3,40.74 51.3,41.3 57.41,47.41 60.42,47.41 64.92,51.91 T_59.-
FROM_T_67  (via drill 0.35)
  Top 0.203: 3.33 v50.16,42.2
  Route 0.508: v50.16,42.2 53.4,45.44 53.4,48 60,54.6 60,60.6 62.07,62.67 T_57.-
FROM_T_68  (via drill 0.35)
  Top 0.203: 3.37 51.55,44.7 v50.16,44.7
  Route 0.508: v50.16,44.7 52.69,47.23 52.69,48.3 53.3,48.91 53.3,60 54.5,61.2 55.4,61.2 57.9,63.7 57.9,70.7 61.26,74.06 66.2,74.06 T_55.-
FROM_T_69  (via drill 0.35)
  Top 0.203: 1.22 v77.21,80.71 v77.2,80.7
  Top 0.406: v67.14,89.98 67.42,89.7 T_14.-
  Route 0.406: v67.14,89.98 67.16,89.96 70.97,89.96 77.26,83.67 77.26,81.03 77.2,80.97 v77.2,80.7
FROM_T_70  (via drill 0.35)
  Top 0.203: 1.26 79.8,82.05 v79.8,80.6
  Route 0.508: v79.8,80.6 79.8,86.4 74.62,91.58 74.22,91.58 72.8,93 T_12.-
FROM_T_71  (via drill 0.35)
  Top 0.203: 1.28 81.02,80.72 v81,80.7
  Route 0.508: T_11.- 77.4,93 80.51,89.89 80.51,81.19 v81,80.7
FROM_T_72
  Top 0.508: 1.10 69.59,84.99 71.4,86.8 76.08,86.8 T_20.-
FROM_T_73  (via drill 0.35)
  Top 0.203: 2.44 79.95,48.55 v80,48.6
  Route 0.508: v80,48.6 78.1,50.5 78.1,72 77.49,72.61 T_29.-
FROM_T_74  (via drill 0.35)
  Top 0.203: 2.40 79.92,46.02 v80,46.1
  Route 0.508: T_31.- 75.83,62.67 77.3,61.2 77.3,48.8 v80,46.1
FROM_T_75  (via drill 0.35)
  Top 0.203: 2.36 79.88,43.48 v79.9,43.5
  Route 0.508: T_33.- 76.4,51.14 76.4,45.7 78.7,43.4 78.8,43.5 v79.9,43.5
FROM_T_76  (via drill 0.35)
  Top 0.203: 2.32 79.86,40.94 v79.9,40.9
  Route 0.508: v79.9,40.9 78.63,40.9 77.09,42.44 T_35.-
FROM_T_77  (via drill 0.35)
  Top 0.203: 2.28 v79.89,38.4 v79.9,38.4
  Route 0.508: T_37.- 74.99,35.49 76.6,37.1 78.6,37.1 v79.9,38.4
FROM_T_78  (via drill 0.35)
  Top 0.203: 2.24 79.86,35.85 v79.9,35.9
  Route 0.508: T_39.- 73.77,23.44 73.77,27.73 73.8,27.76 73.8,28.9 79.15,34.25 79.15,35.15 v79.9,35.9
FROM_T_79  (via drill 0.35)
  Top 0.508: 1.46 92.45,80.59 v92.47,80.57 | v92.49,73.58 93.09,73.58 93.99,72.68 93.99,18.79 89.2,14 74.99,14 T_02.-
  Bottom 0.508: v92.47,80.57 92.47,77.8 94.41,75.86 94.41,74.69 93.58,73.87 92.78,73.87 v92.49,73.58
FROM_T_80  (via drill 0.35)
  Top 0.203: 2.4 79.86,23.16 v79.9,23.2
  Route 0.508: T_49.- 76.2,3.22 76.2,9.3 78.65,11.75 78.65,21.95 v79.9,23.2
FROM_T_81  (via drill 0.35)
  Top 0.508: 2.1 81.23,21.89 80.32,20.98 v79.76,20.98
  Route 0.508: T_48.- 83.8,3.26 83.8,8.8 80.65,11.95 80.65,19.66 79.76,20.55 v79.76,20.98
FROM_T_82  (via drill 0.35)
  Top 0.203: 2.9 80.69,26.96 v80.66,27
  Route 0.508: T_44.- 83.8,13.37 83.8,17.58 84.15,17.93 84.15,19.84 82.91,21.08 82.91,24.75 v80.66,27
FROM_T_83  (via drill 0.35)
  Top 0.203: 2.25 82.08,37.1 v80.76,37.1
  Route 0.508: v80.76,37.1 81.7,37.1 82.32,36.48 82.32,33.02 85.06,30.28 85.06,28.71 85.32,28.44 85.56,28.44 86.28,27.73 86.28,26.72 85.06,25.5 T_36.-
FROM_T_84  (via drill 0.35)
  Top 0.203: v83.22,34.6 83.2,34.59 2.21
  Route 0.508: v83.22,34.6 85.06,32.76 T_38.-
FROM_T_85  (via drill 0.35)
  Top 0.203: 2.29 80.72,39.66 v80.66,39.6
  Route 0.508: v80.66,39.6 82.21,39.6 T_34.-
FROM_T_86  (via drill 0.35)
  Top 0.203: 2.37 80.71,44.74 v80.66,44.8
  Route 0.508: v80.66,44.8 82.89,47.03 82.89,48.09 82.9,48.11 82.9,50.4 T_30.-
FROM_T_87  (via drill 0.35)
  Top 0.203: 2.45 80.68,49.83 v80.66,49.8
  Route 0.508: v80.66,49.8 81.48,50.62 81.48,57.68 81.5,57.71 81.5,61.8 82.37,62.67 T_26.-
FROM_T_88  (via drill 0.35)
  Top 0.203: 2.48 v79.89,51.09 v79.9,51.1
  Route 0.508: T_27.- 84.28,75.28 83.06,74.06 81.36,74.06 79.17,71.87 79.17,51.83 v79.9,51.1
FROM_T_89  (via drill 0.35)
  Top 0.203: 1.32 83.56,80.64 v83.6,80.6
  Route 0.508: v83.6,80.6 83.6,81.43 T_09.-
FROM_T_90  (via drill 0.35)
  Top 0.203: 1.30 v82.29,80.61 v82.3,80.6
  Route 0.508: v82.3,80.6 82.3,83.92 81.34,84.88 81.34,89.28 T_10.-
FROM_T_91
  Top 0.508: 1.36 86.1,86.1 86.8,86.8 86.8,90.19 91.4,94.79 95.01,94.79 95.5,94.3 T_07.-
FROM_T_92  (via drill 0.35)
  Top 0.203: 1.34 84.83,80.83 v84.8,80.8
  Route 0.508: v84.8,80.8 84.8,81.52 87.37,84.09 89.21,84.09 91.99,86.87 96.52,86.87 T_08.-
FROM_T_93  (via drill 0.35)
  Top 0.203: 2.49 80.69,52.37 v80.66,52.4
  Route 0.508: v80.66,52.4 80.63,52.42 80.63,52.7 80.3,53.04 80.3,65.5 84.9,70.1 88.76,70.1 91.36,72.7 95.42,72.7 T_25.-
FROM_T_94  (via drill 0.35)
  Top 0.203: 2.41 80.77,47.28 v80.76,47.3
  Route 0.508: v80.76,47.3 82.19,48.73 82.19,50.7 82.2,50.71 82.2,57.4 85,60.2 88.1,60.2 90.8,62.9 95.27,62.9 T_28.-
FROM_T_95  (via drill 0.35)
  Top 0.203: 2.33 v80.66,42.2
  Route 0.508: v80.66,42.2 80.66,42.46 81.39,43.2 81.39,44.29 83.6,46.5 83.6,47.8 85.5,49.7 87.5,49.7 90.7,52.9 95.16,52.9 T_32.-
FROM_T_96  (via drill 0.35)
  Top 0.508: v95.73,74.85 95.73,74.45 97.69,72.49 97.69,47.57 95.5,45.38 T_01.- | 1.48 v93.72,80.59
  Bottom 0.508: v93.72,80.59 93.72,77.82 95.73,75.81 v95.73,74.85
FROM_T_97  (via drill 0.35)
  Top 0.203: 2.17 82.06,32 v80.66,32
  Top 0.508: 2.17 83.35,32.05 84.47,30.92 85.64,30.92 86.47,31.75 86.47,32.8 v86.68,33.01
  Route 0.508: v86.68,33.01 94.83,33.01 T_40.-
FROM_T_98  (via drill 0.35)
  Top 0.203: 2.13 v80.66,29.5
  Route 0.508: v80.66,29.5 83.64,26.52 83.64,21.42 84.32,20.74 89.02,20.74 90.95,22.67 95.05,22.67 T_42.-
FROM_T_99  (via drill 0.35)
  Top 0.203: 2.5 82.08,24.4 v80.66,24.4
  Route 0.508: T_46.- 95.11,12.5 89.5,12.5 87.7,10.7 84.4,10.7 82.3,12.8 82.3,20.05 81.39,20.96 81.39,23.5 80.66,24.24 v80.66,24.4
FROM_T_100
  Top 0.508: 1.50 95.17,81.92 95.17,81.04 95.83,80.39 95.83,78.57 97.71,76.69 98.58,76.69 99.41,75.86 99.41,74.69 99.3,74.58 99.3,9.79 96.92,7.41 96.92,6.35 95.5,4.94 T_00.-
SHIELD  (via drill 0.75)
  Top 0.61: v22,53 21.36,52.37 4.49
  pour Shield: 0,100 100,100 100,0 0,0
TO_T_1
  Top 0.508: 1.11 70.86,76.65 70.36,76.16 70.36,74.46 69.95,74.05 69.95,73 69.95,72.28 67.8,70.13 44.23,70.13 36.99,62.9 36.99,22.4 34,19.41 23.94,19.41 22.52,17.99 22.52,17.95 9.68,5.11 4.6,5.11 4.5,5.21 T_19.+
TO_T_2  (via drill 0.35)
  Top 0.254: 4.11 19.89,28.23 v19.86,28.2
  Bottom 0.508: T_94.+ 4.5,14.11 5.91,12.7 5.91,11 6.5,11 7.4,11.9 11.9,11.9 13.3,10.5 15.71,10.5 21.3,16.08 21.3,26.76 v19.86,28.2
TO_T_3  (via drill 0.35)
  Top 0.254: 4.3 19.98,23.16 v19.85,23.02
  Route 0.508: v16.41,16.93 15.28,15.8 v15.2,15.8
  Bottom 0.508: T_98.+ 4.5,24.22 3.09,22.81 3.09,21.64 4.5,20.23 4.5,19.2 8,15.7 15.1,15.7 v15.2,15.8 | v16.41,16.93 17.41,16.93 18.91,18.43 18.91,19.56 19.84,20.49 19.84,23.01 v19.85,23.02
TO_T_4  (via drill 0.35)
  Top 0.254: 4.2 19.09,21.89 v19.1,21.9
  Bottom 0.508: T_99.+ 4.5,34.33 5.91,32.92 5.91,30.89 6,30.8 6,21.1 8.35,18.75 8.57,18.53 8.6,18.5 13.96,18.5 13.99,18.52 15.15,18.52 15.17,18.5 16.6,18.5 18.16,20.06 18.16,20.44 18.17,20.45 18.17,20.97 v19.1,21.9
TO_T_5  (via drill 0.35)
  Top 0.254: 4.6 19.07,24.43 v19.1,24.4
  Bottom 0.508: T_97.+ 5.06,47.44 7.9,44.6 7.9,21.59 10.25,19.24 15.95,19.24 17.46,20.75 17.46,22.76 v19.1,24.4
TO_T_6
  Top 0.508: 1.3 65.78,76.18 63.4,73.8 56.82,73.8 55.73,74.9 29.7,74.9 25.92,71.11 9.9,71.11 6.7,67.91 6.7,59.76 T_23.+
TO_T_7  (via drill 0.35)
  Top 0.254: 4.10 19.07,26.96 v19.1,27
  Bottom 0.508: T_95.+ 6.93,67.67 9.6,65 9.6,21.37 10.98,19.99 15.69,19.99 16.72,21.02 16.72,23.75 17.42,24.45 17.42,25.32 v19.1,27
TO_T_8  (via drill 0.35)
  Top 0.254: 4.14 v19.09,29.5 v19.1,29.5
  Bottom 0.508: T_93.+ 5.92,77.78 11.2,72.5 11.2,21.8 12.2,20.8 15.5,20.8 16.01,21.31 16.01,24.04 16.71,24.74 16.71,28.15 18.06,29.5 v19.1,29.5
TO_T_9  (via drill 0.35)
  Top 0.254: 4.18 19.05,32.05 v19.1,32
  Bottom 0.508: T_91.+ 4.5,85.29 12.46,77.33 12.46,26.32 13.51,25.27 15.82,25.27 15.98,25.43 15.98,28.88 v19.1,32
TO_T_10  (via drill 0.35)
  Top 0.508: 1.5 v67.05,80.05 | v66.38,86.62 61.99,91.01 8.5,91.01 4.5,95.01 T_22.+
  Bottom 0.406: v67.05,80.05 67.05,83.83 66.06,84.83 66.06,85.95 66.38,86.28 v66.38,86.62
TO_T_11  (via drill 0.35)
  Top 0.508: 4.50 18.84,52.37 v19.64,53.17
  Bottom 0.254: 14.69,97.89 T_75.+
  Bottom 0.508: v19.64,53.17 19.67,53.17 20.55,54.05 20.55,56.25 22.7,58.4 22.7,63 20.3,65.4 20.3,91.9 14.69,97.52 14.69,97.89
TO_T_12  (via drill 0.35)
  Top 0.254: 4.46 19.02,49.83 v19.1,49.9
  Bottom 0.508: T_77.+ 19.1,83.36 19.1,64 21.61,61.49 21.61,59.21 18.72,56.32 18.72,50.29 v19.1,49.91 v19.1,49.9
TO_T_13  (via drill 0.35)
  Top 0.254: 4.42 19.09,47.28 v19.1,47.3
  Bottom 0.508: v19.1,47.3 19.1,47.46 17.92,48.65 17.92,57.13 17.59,57.45 17.59,74.75 T_79.+
TO_T_14  (via drill 0.35)
  Top 0.254: 4.38 19.1,44.74 v19.14,44.7
  Bottom 0.508: T_81.+ 16.45,65.79 16.45,57.14 17.08,56.51 17.08,47.03 19.14,44.96 v19.14,44.7
TO_T_15  (via drill 0.35)
  Top 0.254: 4.34 v19.14,42.2
  Bottom 0.508: T_83.+ 16.2,55.92 16.2,46.82 17.67,45.35 17.67,43.67 v19.14,42.2
TO_T_16  (via drill 0.35)
  Top 0.254: 4.30 19.04,39.66 v19.1,39.6
  Bottom 0.508: T_85.+ 14.57,44.53 15.98,43.12 15.98,42.72 v19.1,39.6
TO_T_17  (via drill 0.35)
  Top 0.254: 4.26 17.68,37.1 v19.14,37.1
  Bottom 0.508: T_87.+ 18.91,37.33 v19.14,37.1
TO_T_18  (via drill 0.35)
  Top 0.254: 4.22 19.09,34.59 v19.1,34.6
  Bottom 0.508: T_89.+ 13.63,28.16 13.63,28.84 15.51,30.72 15.86,31.07 16,31.21 16,31.5 16,32.05 16,32.62 17.98,34.6 v19.1,34.6
TO_T_19  (via drill 0.35)
  Top 0.254: 4.7 19.95,25.7 v19.86,25.6
  Bottom 0.406: 20.58,24.87 20.58,23.89
  Bottom 0.508: T_96.+ 15.19,17.11 17.4,14.9 20.58,18.08 20.58,23.89 | v19.86,25.6 20.58,24.87
TO_T_20  (via drill 0.35)
  Top 0.254: 4.15 19.93,30.77 v19.9,30.8
  Bottom 0.508: T_92.+ 20.37,7 22.5,9.13 22.5,28.2 v19.9,30.8
TO_T_21  (via drill 0.35)
  Top 0.254: 4.19 21.34,33.3 v19.9,33.3
  Bottom 0.508: v19.9,33.3 22.5,30.7 22.5,30.52 23.21,29.81 23.21,8.68 24.64,7.25 T_90.+
TO_T_22
  Top 0.508: T_04.+ 24.64,15.16 64.96,15.16 66.33,16.53 66.33,47.04 75.17,55.88 80.17,55.88 85.55,61.26 85.64,61.26 86.47,62.08 86.47,71.12 88.44,73.09 88.43,73.09 89.81,74.47 89.81,78.3 1.41
TO_T_23  (via drill 0.35)
  Top 0.254: 4.23 19.87,35.85 v19.82,35.9
  Bottom 0.508: v19.82,35.9 19.82,35.76 23.21,32.37 23.21,30.81 24.64,29.38 T_88.+
TO_T_24  (via drill 0.35)
  Top 0.254: 4.27 v19.91,38.4 v19.9,38.4
  Bottom 0.508: T_86.+ 22.27,37.33 21.2,38.4 v19.9,38.4
TO_T_25  (via drill 0.35)
  Top 0.254: 4.47 v20.77,51.09 v20.76,51.09
  Bottom 0.254: 24.7,47.38 T_76.+
  Bottom 0.508: v20.76,51.09 24.47,47.38 24.7,47.38
TO_T_26  (via drill 0.35)
  Top 0.254: 4.43 21.3,48.5 v19.9,48.5
  Bottom 0.254: 23.8,41 25.8,41
  Bottom 0.508: T_78.+ 26.3,55.89 26.3,41.5 25.8,41 | v19.9,48.5 22.9,45.5 22.9,41.9 23.8,41
TO_T_27  (via drill 0.35)
  Top 0.254: 4.39 21.34,46 v19.9,46
  Bottom 0.254: 21.55,44.35 21.56,44.34 21.56,44 | 22.92,40.38 26.62,40.38
  Bottom 0.508: 26.62,40.38 27.3,41.05 27.3,65.01 T_80.+ | v19.9,46 21.55,44.35 | 21.56,44 21.56,41.74 22.92,40.38
TO_T_28
  Top 0.508: T_24.+ 24.97,77.78 27.61,80.41 63.72,80.41 64.51,79.62 1.1
TO_T_29  (via drill 0.35)
  Top 0.254: 4.35 21.27,43.4 v19.9,43.4
  Bottom 0.254: 22.6,39.5 26.7,39.5
  Bottom 0.508: 26.7,39.5 27.3,39.5 28.6,40.8 28.6,83.93 T_82.+ | v19.9,43.4 19.9,43.24 20.63,42.5 20.63,41.47 22.6,39.5
TO_T_30  (via drill 0.35)
  Top 0.254: 4.31 19.93,40.94 v19.9,40.9
  Bottom 0.508: 26.7,38.62 28.32,38.62 29.9,40.2 29.9,94.7 26.6,98 T_84.+ | v19.9,40.9 19.9,40.82 22.1,38.62 23.93,38.62 24.05,38.74 25.22,38.74 25.35,38.62 26.7,38.62 | 26.7,38.62
TO_T_31  (via drill 0.35)
  Top 0.203: 3.46 49.38,49.83 v49.4,49.8
  Bottom 0.508: T_52.+ 41.2,91.51 41.2,74.36 48.6,66.96 48.6,50.6 v49.4,49.8
TO_T_32  (via drill 0.35)
  Top 0.203: 3.42 49.38,47.28 v49.4,47.3
  Bottom 0.508: v49.4,47.3 47.61,49.09 47.61,66.83 38.91,75.53 38.91,83.69 T_54.+
TO_T_33  (via drill 0.35)
  Top 0.203: 3.34 v49.4,42.2
  Bottom 0.508: T_58.+ 38.2,74.29 38.2,67.1 46,59.3 46,58.33 46.19,58.14 46.19,46.86 46,46.67 46,45.3 49.1,42.2 v49.4,42.2
TO_T_34  (via drill 0.35)
  Top 0.203: 3.30 49.34,39.66 v49.4,39.6
  Bottom 0.508: T_60.+ 41.2,61.17 41.2,54.57 42.22,53.55 42.22,42.98 45.6,39.6 v49.4,39.6
TO_T_35  (via drill 0.35)
  Top 0.203: 3.18 49.35,32.05 v49.4,32
  Bottom 0.508: v49.4,32 46.19,28.79 46.19,21.64 45.7,21.15 45.7,21.1 45.65,21.1 45.36,20.81 44.19,20.81 39.4,25.61 39.4,47.08 36.25,50.23 36.25,56.01 T_66.+
TO_T_36  (via drill 0.35)
  Top 0.203: 3.14 v49.4,29.5
  Bottom 0.508: T_68.+ 38.4,43.75 38.4,24 42.39,20.01 45.62,20.01 46.9,21.29 46.9,27 v49.4,29.5
TO_T_37  (via drill 0.35)
  Top 0.203: 3.10 49.34,26.96 v49.4,26.9
  Bottom 0.203: 46.49,19.61 46.2,19.31 41.49,19.31 41.23,19.57
  Bottom 0.508: 41.23,19.57 36.7,24.1 36.7,35.34 T_70.+ | 46.49,19.61 47.64,20.76 47.64,25.14 v49.4,26.9
TO_T_38  (via drill 0.35)
  Top 0.203: 3.6 49.38,24.43 v49.4,24.4
  Bottom 0.203: 41,18.81 47,18.81 47.25,19.05 47.35,19.05
  Bottom 0.508: T_72.+ 34.8,27.13 34.8,24.12 40.12,18.81 41,18.81 | v49.4,24.4 48.35,23.36 48.35,20.06 47.35,19.05
TO_T_39  (via drill 0.35)
  Top 0.203: 3.2 49.28,21.89 v49.3,21.9
  Bottom 0.203: 47.9,18.4 47,18.4 43.2,18.4 42.7,17.9
  Bottom 0.508: T_74.+ 41.91,17.11 42.7,17.9 | v49.3,21.9 49.07,21.67 49.07,19.57 47.9,18.4
TO_T_40  (via drill 0.35)
  Top 0.203: 3.7 v50.16,25.7
  Bottom 0.203: 50.16,25.6 v50.16,25.7
  Bottom 0.508: T_71.+ 41.7,7 51.61,16.91 51.61,23.98 50.16,25.44 50.16,25.6
TO_T_41  (via drill 0.35)
  Top 0.203: 3.11 50.19,28.23 v50.16,28.2
  Bottom 0.508: v50.16,28.2 52.5,25.86 52.5,14.72 T_69.+
TO_T_42  (via drill 0.35)
  Top 0.203: 3.3 50.21,23.16 v50.16,23.1
  Bottom 0.508: T_73.+ 45.29,16.6 47.9,16.6 50.61,19.31 50.61,22.65 v50.16,23.1
TO_T_43  (via drill 0.35)
  Top 0.203: 3.22 49.31,34.59 v49.4,34.5
  Bottom 0.508: T_64.+ 44.78,29.88 v49.4,34.5
TO_T_44  (via drill 0.35)
  Top 0.203: 3.26 49.38,37.12 v49.4,37.1
  Bottom 0.508: v49.4,37.1 45.01,37.1 T_62.+
TO_T_45
  Top 0.508: 1.13 72.13,76.92 71.08,75.86 71.08,74.69 72.07,73.7 72.5,73.7 72.49,73.69 72.49,71.81 66.19,65.5 50.9,65.5 44.6,59.2 43.5,59.2 43,58.7 43,48.5 43.25,48.25 44.06,47.44 T_18.+
TO_T_46
  Top 0.508: 1.15 73.4,76.36 73.9,75.86 73.9,72.2 66.48,64.79 64.02,64.79 58.91,59.68 53.97,59.68 51.85,57.56 T_17.+
TO_T_47  (via drill 0.35)
  Top 0.203: 3.38 49.35,44.74 v49.4,44.7
  Bottom 0.508: v49.4,44.7 46.9,47.2 46.9,65.55 T_56.+
TO_T_48  (via drill 0.35)
  Top 0.203: 3.50 49.34,52.37 v49.4,52.3
  Bottom 0.508: T_50.+ 49.7,72.86 49.7,53.3 49.4,53 v49.4,52.3
TO_T_49  (via drill 0.35)
  Top 0.203: 1.17 74.67,79.77 v74.7,79.8
  Bottom 0.203: v74.7,79.8 74.7,79.98 75.18,80.46 75.18,81.3
  Bottom 0.508: T_16.+ 51.77,80.9 55.4,80.9 61.8,87.3 66.03,87.3 66.08,87.35 69.76,87.35 71.08,86.04 71.08,84.81 71.9,83.98 72.22,83.98 74.77,81.43 74.9,81.43 75.04,81.3 75.18,81.3
TO_T_50  (via drill 0.35)
  Top 0.508: 1.7 68.32,80.08 v68.3,80.1 | T_21.+ 44.78,95.81 65.69,95.81 69.49,92.02 v69.49,86.59
  Bottom 0.406: v68.3,80.1 68.3,84.35 68.78,84.83 68.78,85.88 v69.49,86.59
TO_T_51  (via drill 0.35)
  Top 0.203: 1.23 78.48,79.88 v78.5,79.9
  Bottom 0.203: v78.5,79.9 78.5,79.97 79.06,80.53 79.06,81.3
  Bottom 0.508: 79.06,81.3 78.9,81.46 78.9,85.9 78.9,85.97 74.04,90.83 59.57,90.83 54.85,95.55 T_13.+
TO_T_52  (via drill 0.35)
  Top 0.203: 1.19 75.94,79.76 v75.9,79.8
  Bottom 0.203: v75.9,79.8 76.22,80.12 76.24,80.12 76.58,80.46 76.58,81.4
  Bottom 0.508: T_15.+ 55.35,88.39 71.54,88.39 76.58,83.35 76.58,81.4
TO_T_53  (via drill 0.35)
  Top 0.203: 3.47 v50.16,51.09 v50.16,51.1
  Bottom 0.508: v50.16,51.1 51.1,52.04 51.1,74.03 T_51.+
TO_T_54  (via drill 0.35)
  Top 0.203: 3.43 50.21,48.55 v50.16,48.5
  Bottom 0.508: T_53.+ 51.99,64.81 51.99,50.33 v50.16,48.5
TO_T_55
  Top 0.508: 1.37 87.37,77.09 85.22,74.93 85.22,74.33 75.78,64.9 69.21,64.9 59.63,55.32 54.85,55.32 T_06.+
TO_T_56
  Top 0.508: 1.39 88.97,78.08 88.97,74.69 87.38,73.1 86.1,73.1 83.11,70.12 83.11,68.68 59.99,45.56 54.85,45.56 T_05.+
TO_T_57  (via drill 0.35)
  Top 0.203: 3.23 51.55,35.8 v50.16,35.8
  Bottom 0.508: v50.16,35.8 53.31,35.8 T_63.+
TO_T_58  (via drill 0.35)
  Top 0.203: 3.19 51.59,33.3 v50.16,33.3
  Bottom 0.508: v50.16,33.3 54.85,28.61 T_65.+
TO_T_59  (via drill 0.35)
  Top 0.203: 3.15 50.18,30.77 v50.16,30.8
  Bottom 0.508: v50.16,30.8 53.3,27.66 53.3,18.66 T_67.+
TO_T_60
  Top 0.508: 1.43 91.18,76.46 90.78,76.06 90.78,74.37 89.46,73.05 89.46,21.91 87.4,19.85 74.68,19.85 63.25,8.42 56.85,8.42 55.43,7 T_03.+
TO_T_61  (via drill 0.35)
  Top 0.203: 2.6 79.88,24.43 v79.9,24.4
  Bottom 0.508: T_47.+ 66,7 66.96,7.96 66.96,11.74 74.61,19.39 76.16,19.39 77.84,21.07 77.84,22.84 79.4,24.4 v79.9,24.4
TO_T_62  (via drill 0.35)
  Top 0.203: 2.10 79.86,26.96 v79.9,27
  Bottom 0.508: v79.9,27 77.11,24.21 77.11,21.34 75.86,20.1 70.56,20.1 67.57,17.11
  Bottom 0.61: T_45.+ 67.57,17.11
TO_T_63  (via drill 0.35)
  Top 0.203: 2.14 v79.89,29.5 v79.9,29.5
  Bottom 0.508: v79.9,29.5 78.41,29.5 77.21,28.3 77.21,25.4 76.34,24.53 76.34,22.86 76.4,22.81 76.4,21.64 75.57,20.81 72.08,20.81 70.72,22.17 68.96,22.17 68.94,22.19 67.5,22.19 64.92,24.77 T_43.+
TO_T_64  (via drill 0.35)
  Top 0.203: 2.18 79.86,32.05 v79.9,32
  Bottom 0.508: v79.9,32 76.5,28.6 76.5,27.52 76.4,27.42 76.4,26.11 74.92,24.64 74.35,24.64 72.73,24.64 72.3,25.07 72.3,26.11 72.27,26.14 70.8,27.64 70.8,31.4 68.12,34.08 68.12,34.12 T_41.+
TO_T_65  (via drill 0.35)
  Top 0.203: 3.27 50.25,38.4 v50.16,38.3
  Bottom 0.508: T_61.+ 62.24,47.44 53.1,38.3 v50.16,38.3
TO_T_66  (via drill 0.35)
  Top 0.203: 3.31 51.56,40.9 v50.16,40.9
  Bottom 0.508: v50.16,40.9 50.9,40.9 57.39,47.39 60.4,47.39 63.44,50.42 63.44,53.44 64.92,54.92 T_59.+
TO_T_67  (via drill 0.35)
  Top 0.203: 3.35 50.18,43.48 v50.16,43.5
  Bottom 0.508: T_57.+ 64.9,67.65 62.25,67.65 60,65.4 60,54.6 55,49.6 55,49.59 53.44,48.03 53.44,46.78 v50.16,43.5
TO_T_68  (via drill 0.35)
  Top 0.203: 3.39 51.59,46 v50.16,46
  Bottom 0.508: T_55.+ 58,70.86 58,63.83 55.43,61.26 54.56,61.26 53.3,60 53.3,49.14 v50.16,46
TO_T_69  (via drill 0.35)
  Top 0.203: 1.21 v77.2,79.8
  Top 0.406: v61.31,89.46 61.31,86.5 T_14.+
  Bottom 0.254: v77.2,79.8 77.81,80.41 77.81,81.38
  Bottom 0.406: 77.81,81.38 77.81,83.05 71.81,89.05 61.72,89.05 v61.31,89.46
TO_T_70  (via drill 0.35)
  Top 0.203: 1.25 79.75,79.79 v79.8,79.84
  Bottom 0.203: v79.8,79.84 79.97,80.02 80.04,80.02 80.38,80.36 80.38,81.2
  Bottom 0.508: 80.38,81.2 79.7,81.88 79.7,86.47 74.61,91.56 74.24,91.56 71.5,94.3 68.62,94.3 T_12.+
TO_T_71  (via drill 0.35)
  Top 0.203: 1.27 81.02,79.78 v81,79.8
  Bottom 0.203: v81,79.8 81,79.88 81.58,80.46 81.58,81.2
  Bottom 0.508: 81.58,81.2 81.1,81.68 81.1,83.61 80.41,84.3 80.41,89.99 74.99,95.41 T_11.+
TO_T_72  (via drill 0.35)
  Top 0.508: 1.9 v69.59,80.11 v69.6,80.12 | v70.32,84.5 71.21,85.39 T_20.+
  Bottom 0.406: v69.6,80.12 69.6,83.78 v70.32,84.5
TO_T_73  (via drill 0.35)
  Top 0.203: 2.42 79.98,47.28 v80,47.3
  Bottom 0.508: v80,47.3 78.01,49.29 78.01,72.09 74.82,75.28 T_29.+
TO_T_74  (via drill 0.35)
  Top 0.203: 2.38 79.84,44.74 v79.9,44.8
  Bottom 0.508: v79.9,44.8 77.3,47.4 77.3,65.35 T_31.+
TO_T_75  (via drill 0.35)
  Top 0.203: 2.34 v79.89,42.2 v79.9,42.2
  Bottom 0.508: T_33.+ 74.99,54.71 76.4,53.3 76.4,46.86 76.3,46.77 76.3,45.8 v79.9,42.2
TO_T_76  (via drill 0.35)
  Top 0.203: 2.30 79.83,39.66 v79.9,39.6
  Bottom 0.508: T_35.+ 74.99,44.51 v79.9,39.6
TO_T_77  (via drill 0.35)
  Top 0.203: 2.26 79.88,37.12 v79.9,37.1
  Bottom 0.61: v79.9,37.1 75.22,37.1 T_37.+
TO_T_78  (via drill 0.35)
  Top 0.203: 2.22 79.89,34.59 v79.9,34.6
  Bottom 0.61: v79.9,34.6 74.99,29.69 T_39.+
TO_T_79
  Top 0.508: 1.45 92.45,76.72 91.59,75.86 91.59,73.3 92.1,72.79 92.87,72.79 93.18,72.48 93.18,18.99 88.91,14.71 74.99,14.71 T_02.+
TO_T_80  (via drill 0.35)
  Top 0.203: 2.2 78.42,21.9 v79.9,21.9
  Bottom 0.508: T_49.+ 74.99,8.13 78.65,11.79 78.65,21.61 78.94,21.9 v79.9,21.9
TO_T_81  (via drill 0.35)
  Top 0.203: 2.3 80.7,23.16 v80.66,23.2
  Bottom 0.508: T_48.+ 85.06,7.45 80.66,11.85 v80.66,23.2
TO_T_82  (via drill 0.35)
  Top 0.203: 2.11 82.06,28.2 v80.66,28.2
  Bottom 0.508: v80.66,28.2 82.9,25.96 82.9,21.25 85.06,19.1 T_44.+
TO_T_83  (via drill 0.35)
  Top 0.203: 2.27 80.75,38.4 v80.66,38.3
  Bottom 0.508: T_36.+ 85.06,29.42 85.06,30.34 82.31,33.09 82.31,37.13 81.14,38.3 v80.66,38.3
TO_T_84  (via drill 0.35)
  Top 0.203: v83.26,35.89 83.22,35.85 2.23
  Bottom 0.508: v83.26,35.89 84.7,37.33 T_38.+
TO_T_85  (via drill 0.35)
  Top 0.203: 2.31 80.69,40.94 v80.66,40.9
  Bottom 0.508: T_34.+ 85.06,45.3 v80.66,40.9
TO_T_86  (via drill 0.35)
  Top 0.203: 2.39 82.08,46 v80.76,46
  Bottom 0.508: T_30.+ 85.06,54.84 82.89,52.68 82.89,47.7 81.19,46 v80.76,46
TO_T_87  (via drill 0.35)
  Top 0.203: 2.47 v80.66,51.09 v80.66,51.1
  Bottom 0.508: v80.66,51.1 81.47,51.91 81.47,64.08 T_26.+
TO_T_88  (via drill 0.35)
  Top 0.203: 2.46 78.42,49.8 v79.9,49.8
  Bottom 0.508: T_27.+ 79.17,71.89 79.17,50.53 v79.9,49.8
TO_T_89  (via drill 0.35)
  Top 0.203: 1.31 83.56,79.74 v83.5,79.8
  Bottom 0.203: v83.5,79.8 83.72,80.02 83.84,80.02 84.18,80.36 84.18,81.29 84.19,81.3
  Bottom 0.508: 84.19,81.3 84.19,83.75 T_09.+
TO_T_90  (via drill 0.35)
  Top 0.203: 1.29 v82.29,79.79 v82.3,79.8
  Bottom 0.203: v82.3,79.8 82.52,80.02 82.54,80.02 82.88,80.36 82.88,81.08 82.9,81.1
  Bottom 0.508: 82.9,81.1 82.9,83 81.15,84.75 81.15,94.09 T_10.+
TO_T_91  (via drill 0.35)
  Top 0.203: 86.1,79 1.35 | v89.63,85.6 89.63,85.59 89.64,85.58
  Top 0.508: T_07.+ 95.5,95.5 91.1,95.5 86,90.4 86,87 85.19,86.19 85.19,85.82 | 89.64,85.58 v90.69,84.53
  Top 0.61: v86.1,80.09 86.1,79 | 85.19,85.82 v85.17,85.82
  Bottom 0.305: 86.63,80.92 86.1,80.39 v86.1,80.09
  Bottom 0.406: 88.14,86.8 89.34,85.6 v89.63,85.6
  Bottom 0.508: 86.63,80.92 88.98,83.27 89.34,83.27 90.6,84.52 90.68,84.52 v90.69,84.53 | v85.17,85.82 85.39,85.6 85.77,85.6 86.97,86.8 88.14,86.8
TO_T_92  (via drill 0.35)
  Top 0.508: 1.33 84.83,79.77 v84.8,79.8
  Bottom 0.305: 85.56,80.99 85.56,80.56 v84.8,79.8
  Bottom 0.508: 85.56,80.99 85.56,82.32 87.22,83.98 89.05,83.98 91.18,86.11 92.28,86.11 T_08.+
TO_T_93  (via drill 0.35)
  Top 0.203: 2.50 79.86,52.37 v79.9,52.4
  Bottom 0.508: T_25.+ 91.54,73.82 91.54,72.88 88.81,70.15 85,70.15 80.3,65.45 80.3,54 79.9,53.6 v79.9,52.4
TO_T_94  (via drill 0.35)
  Top 0.203: 2.43 80.8,48.55 v80.76,48.6
  Bottom 0.508: v80.76,48.6 82.18,50.02 82.18,57.58 84.75,60.15 86,60.15 87.98,60.15 T_28.+
TO_T_95  (via drill 0.35)
  Top 0.203: 2.35 80.68,43.48 v80.66,43.5
  Bottom 0.508: v80.66,43.5 83.6,46.44 83.6,48 85.3,49.7 87.64,49.7 T_32.+
TO_T_96
  Top 0.508: T_01.+ 96.45,47.44 96.98,47.97 96.98,72.19 94.89,74.28 94.89,75.19 94.93,75.23 94.93,76.03 93.72,77.24 1.47
TO_T_97  (via drill 0.35)
  Top 0.508: 2.19 84.04,33.31 84.47,33.74 85.64,33.74 v86.24,33.74
  Bottom 0.508: T_40.+ 91.91,33.74 v86.24,33.74
TO_T_98  (via drill 0.35)
  Top 0.203: 2.15 80.73,30.77 v80.66,30.7
  Bottom 0.508: v80.66,30.7 83.61,27.75 83.61,21.55 84.41,20.75 89.03,20.75 T_42.+
TO_T_99  (via drill 0.35)
  Top 0.203: 2.7 v80.66,25.7
  Bottom 0.508: T_46.+ 94.1,17.11 87.69,10.7 84.39,10.7 82.31,12.78 82.31,20.03 82.04,20.3 82.04,24.32 v80.66,25.7
TO_T_100
  Top 0.508: 1.49 96.59,76.8 96.59,74.69 98.58,72.7 98.58,10.08 T_00.+